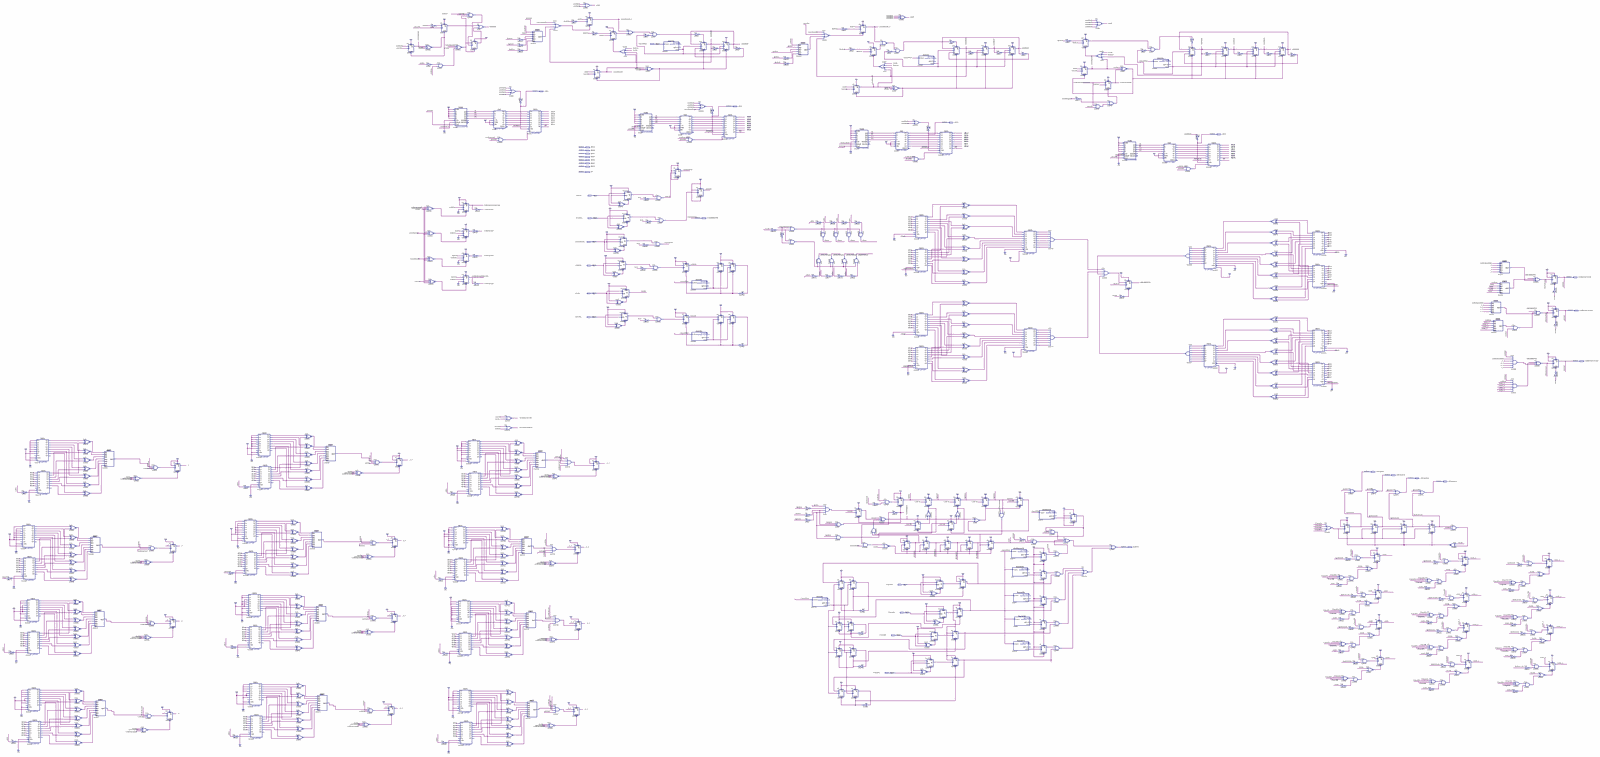
[diagram p0: schematic sheet, whole]
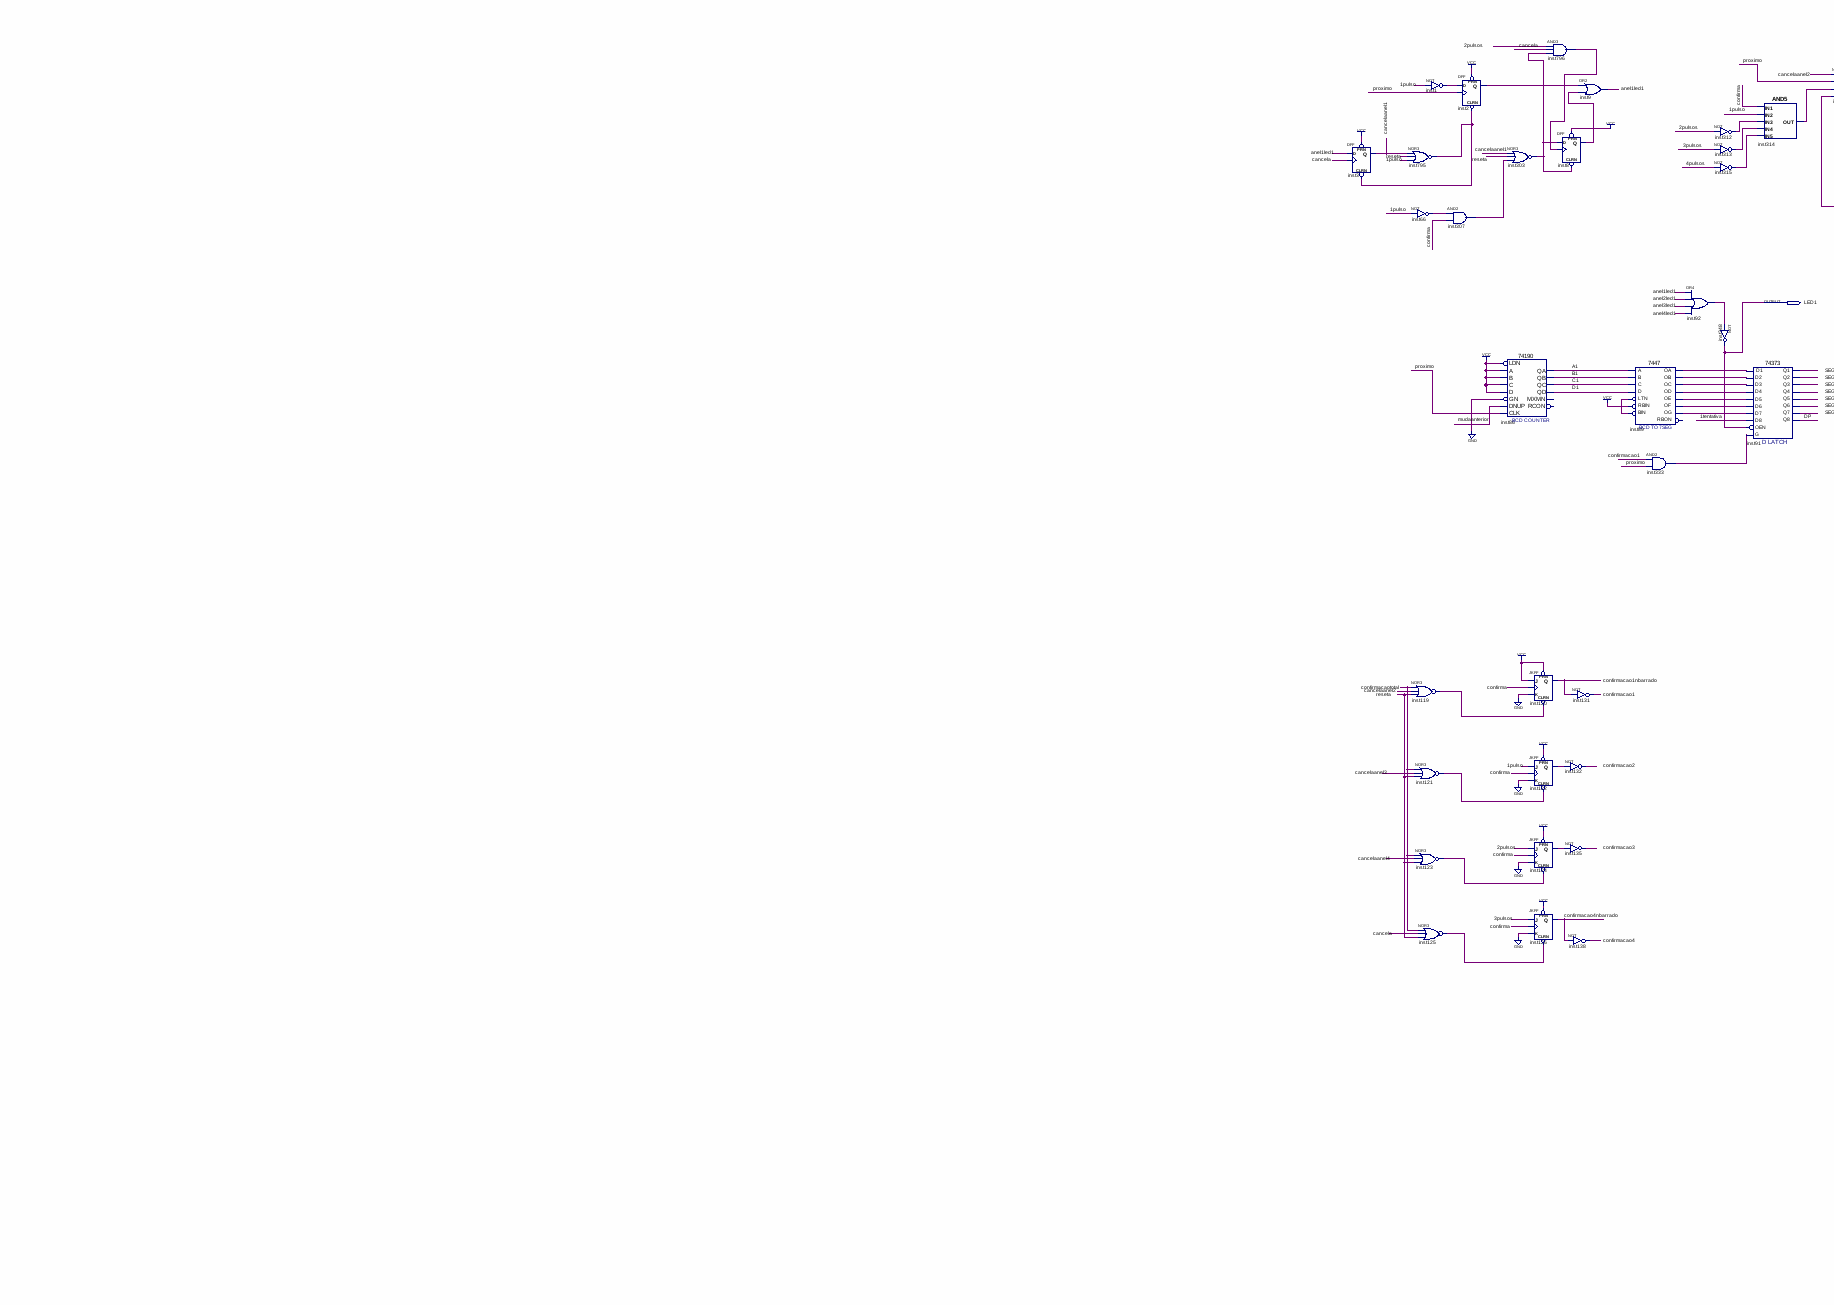
[diagram p1: schematic sheet, upper left part]
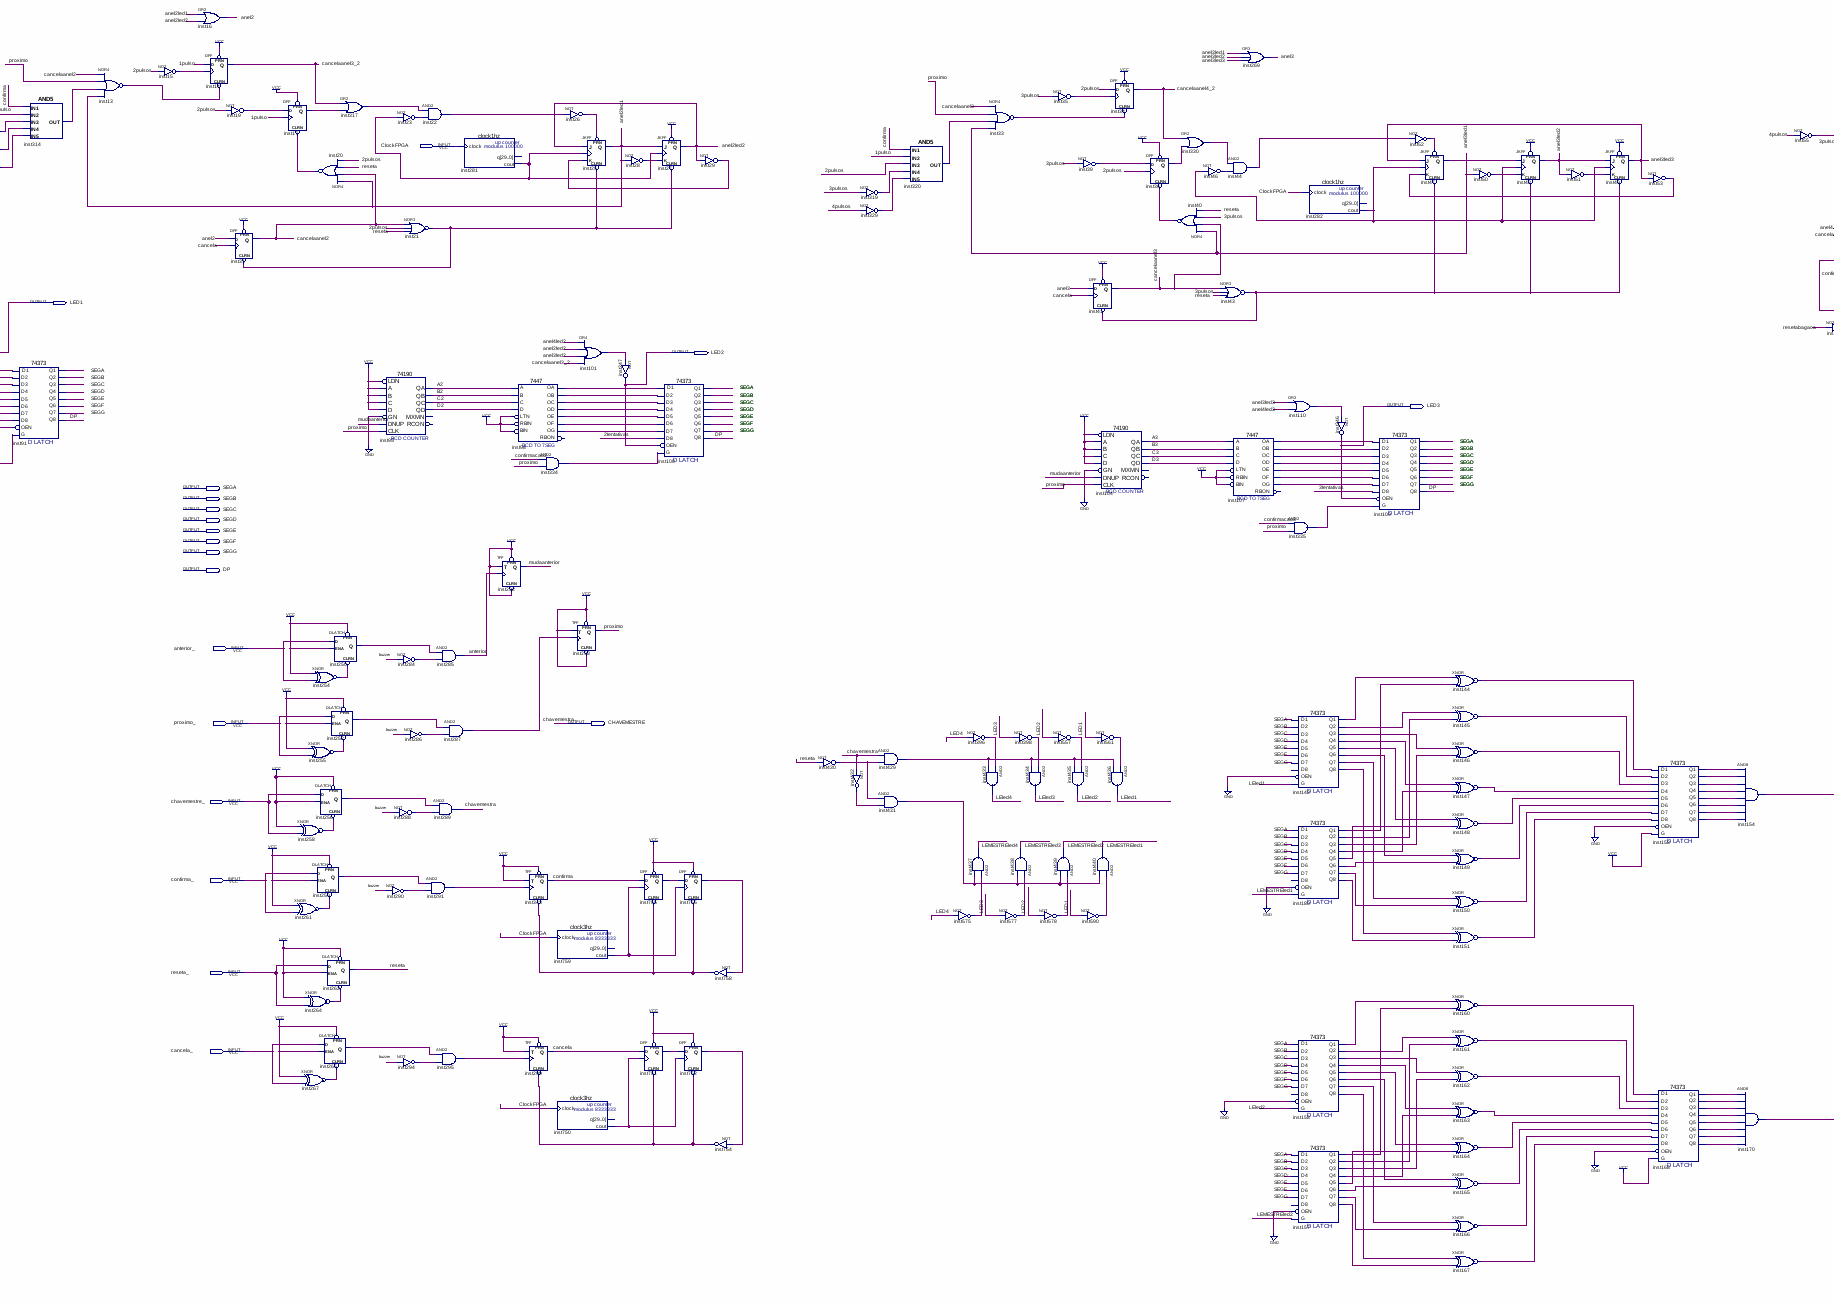
[diagram p2: schematic sheet, upper centre part]
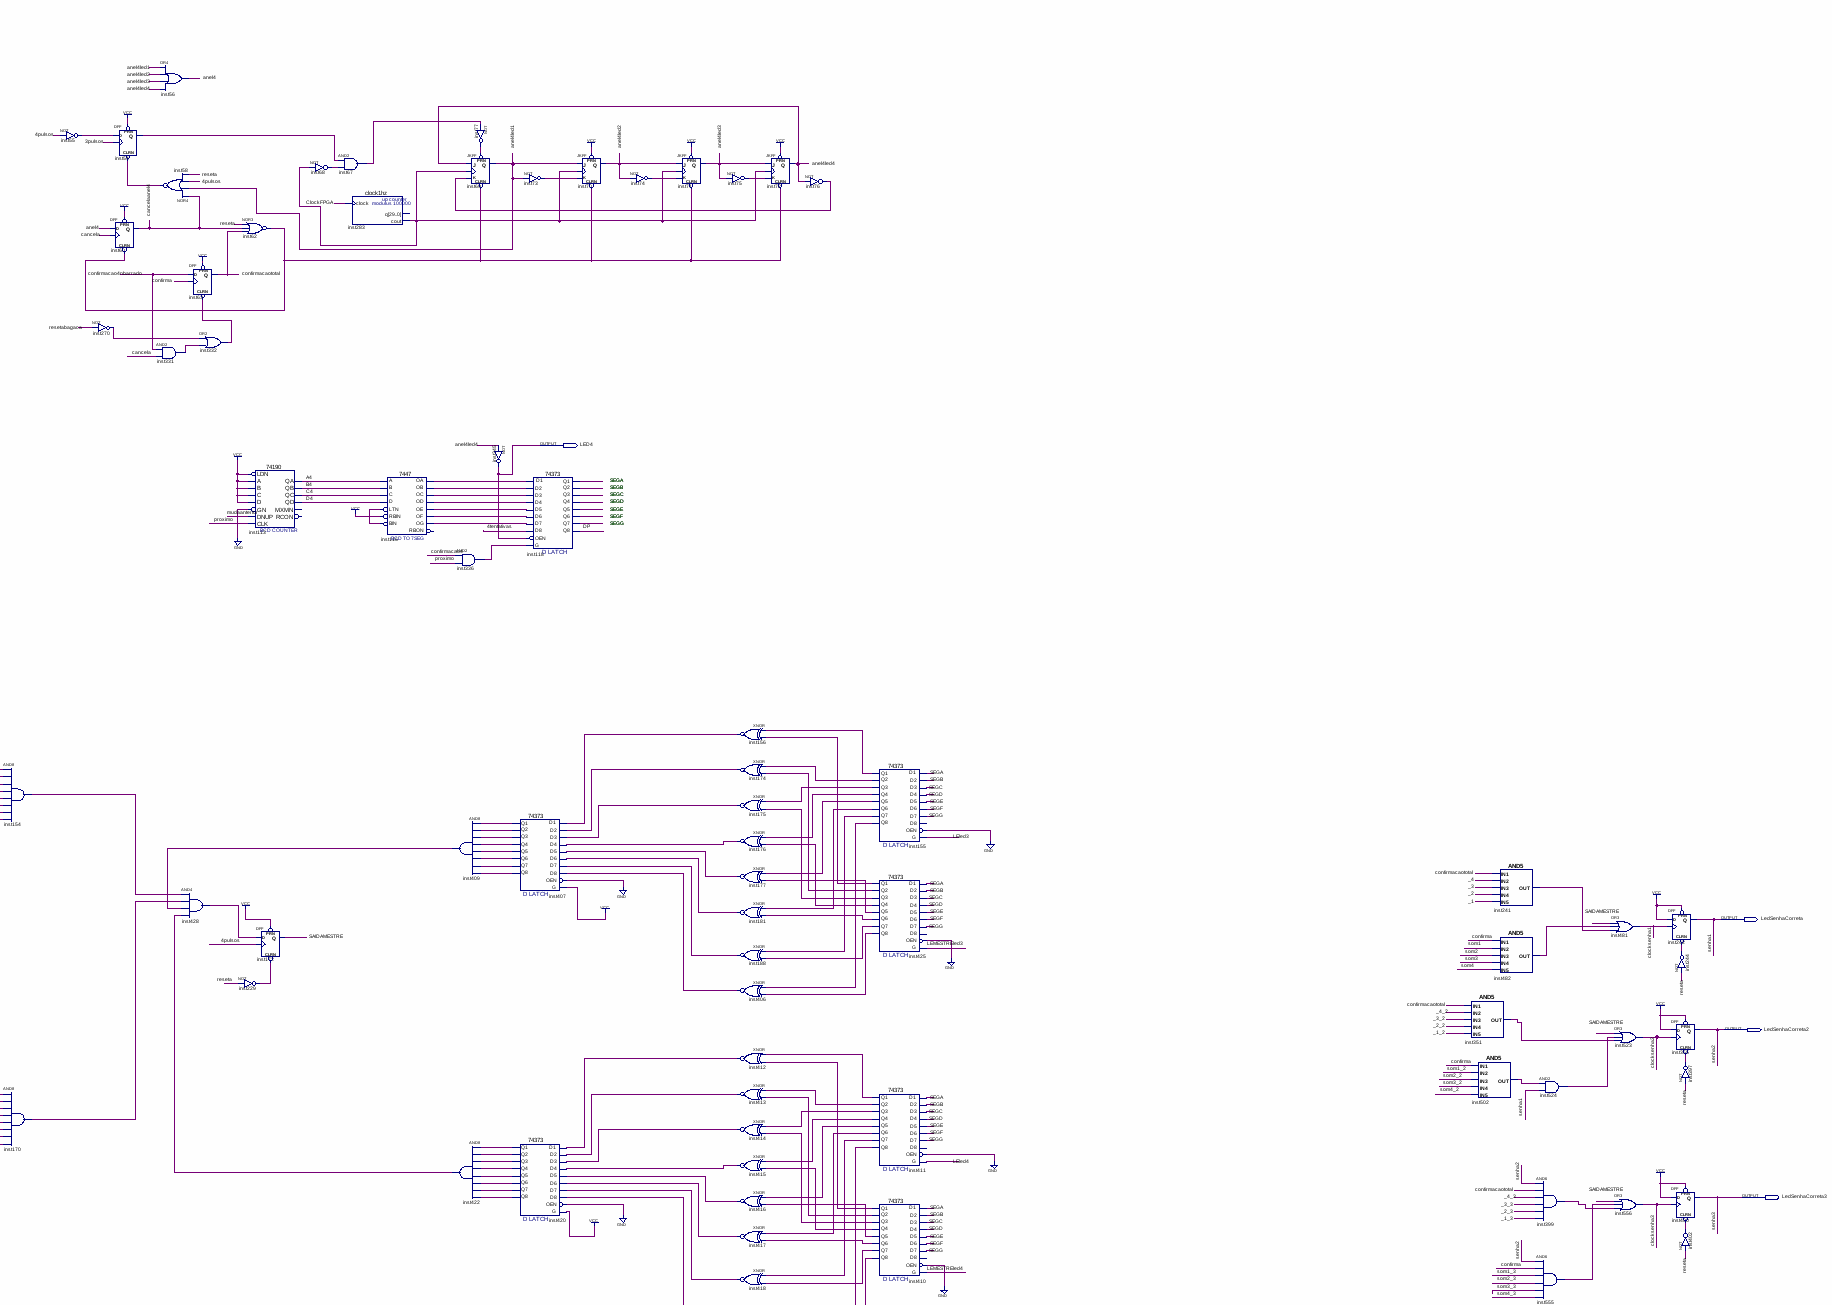
[diagram p3: schematic sheet, upper right part]
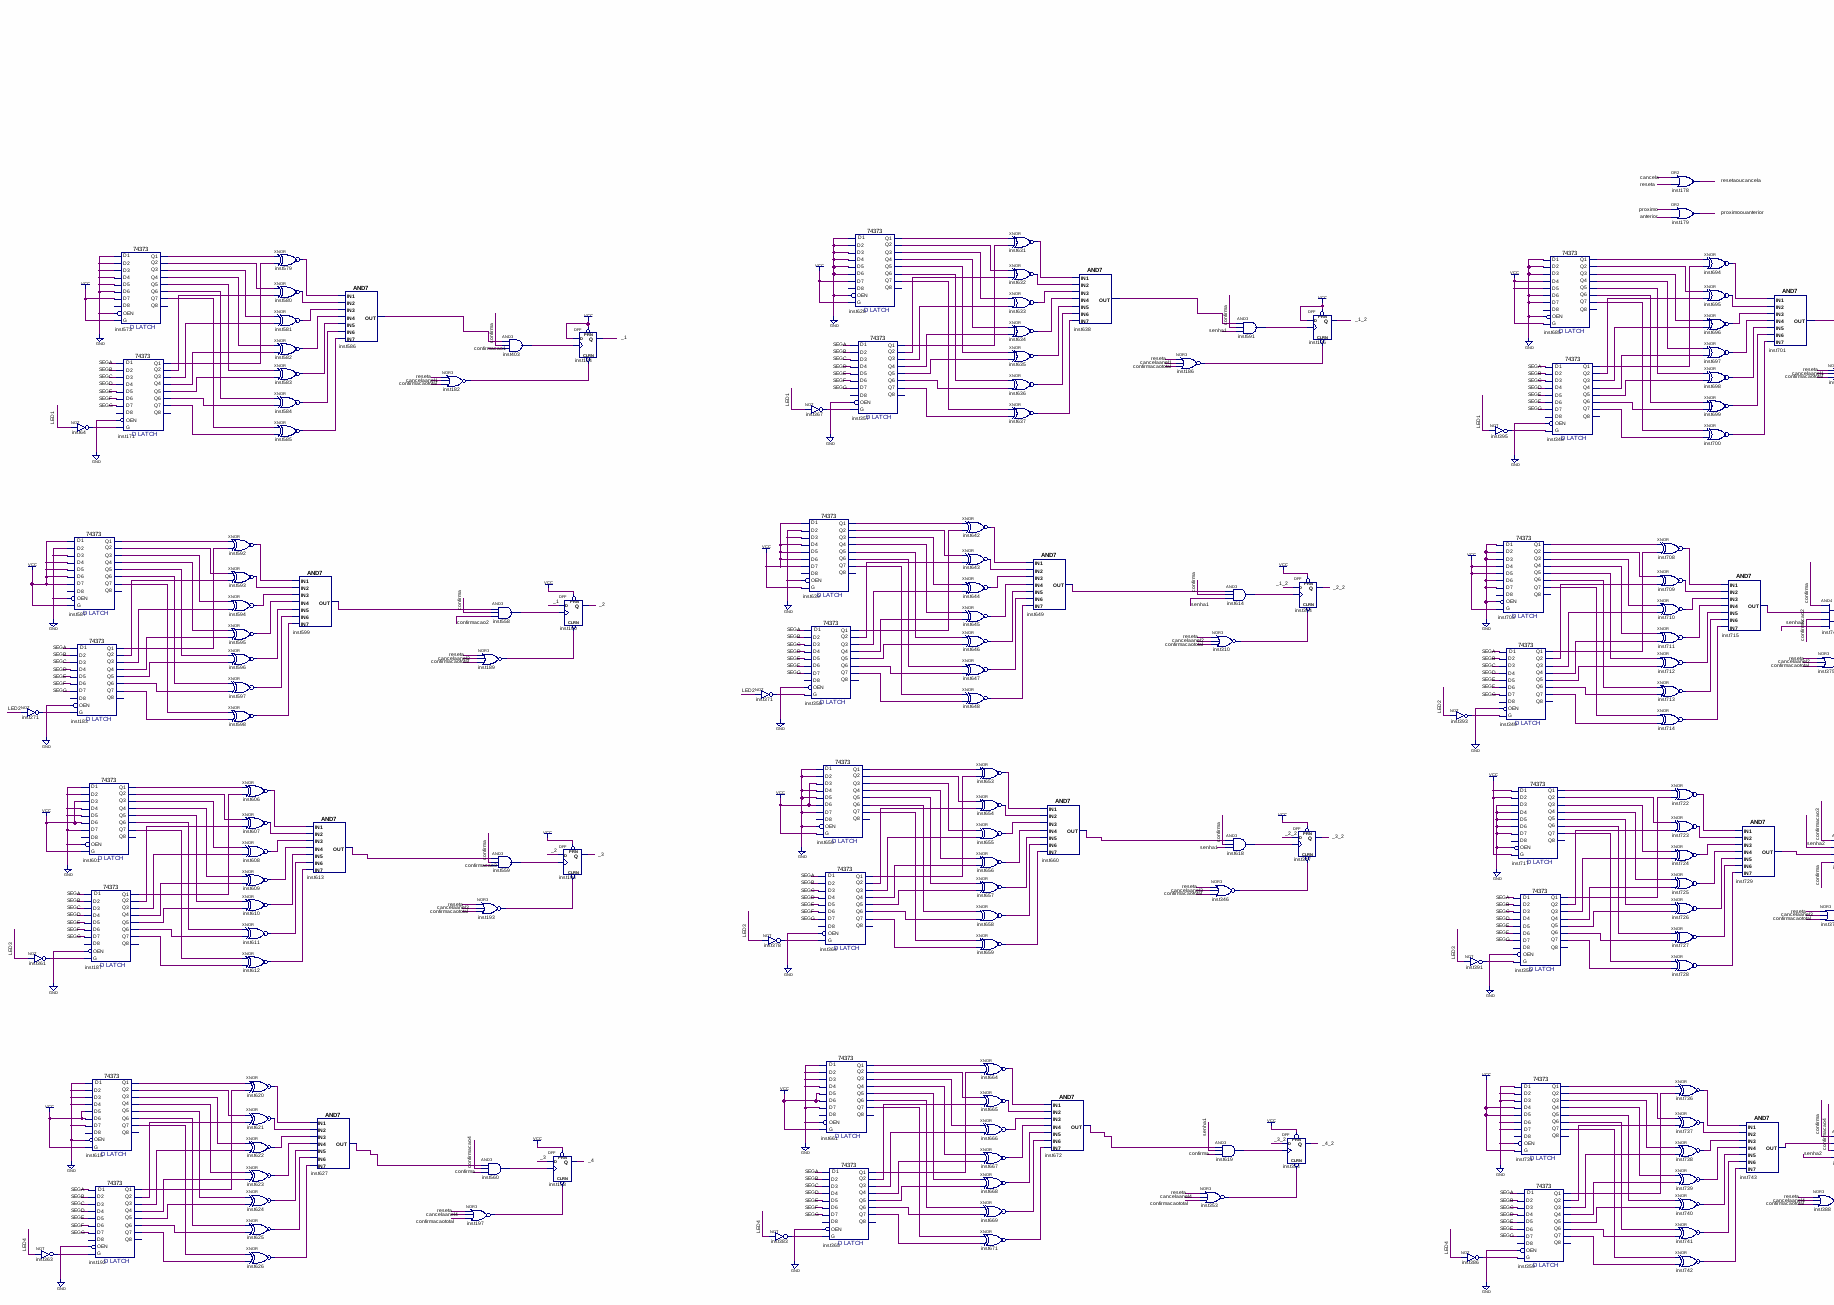
[diagram p4: schematic sheet, lower left part]
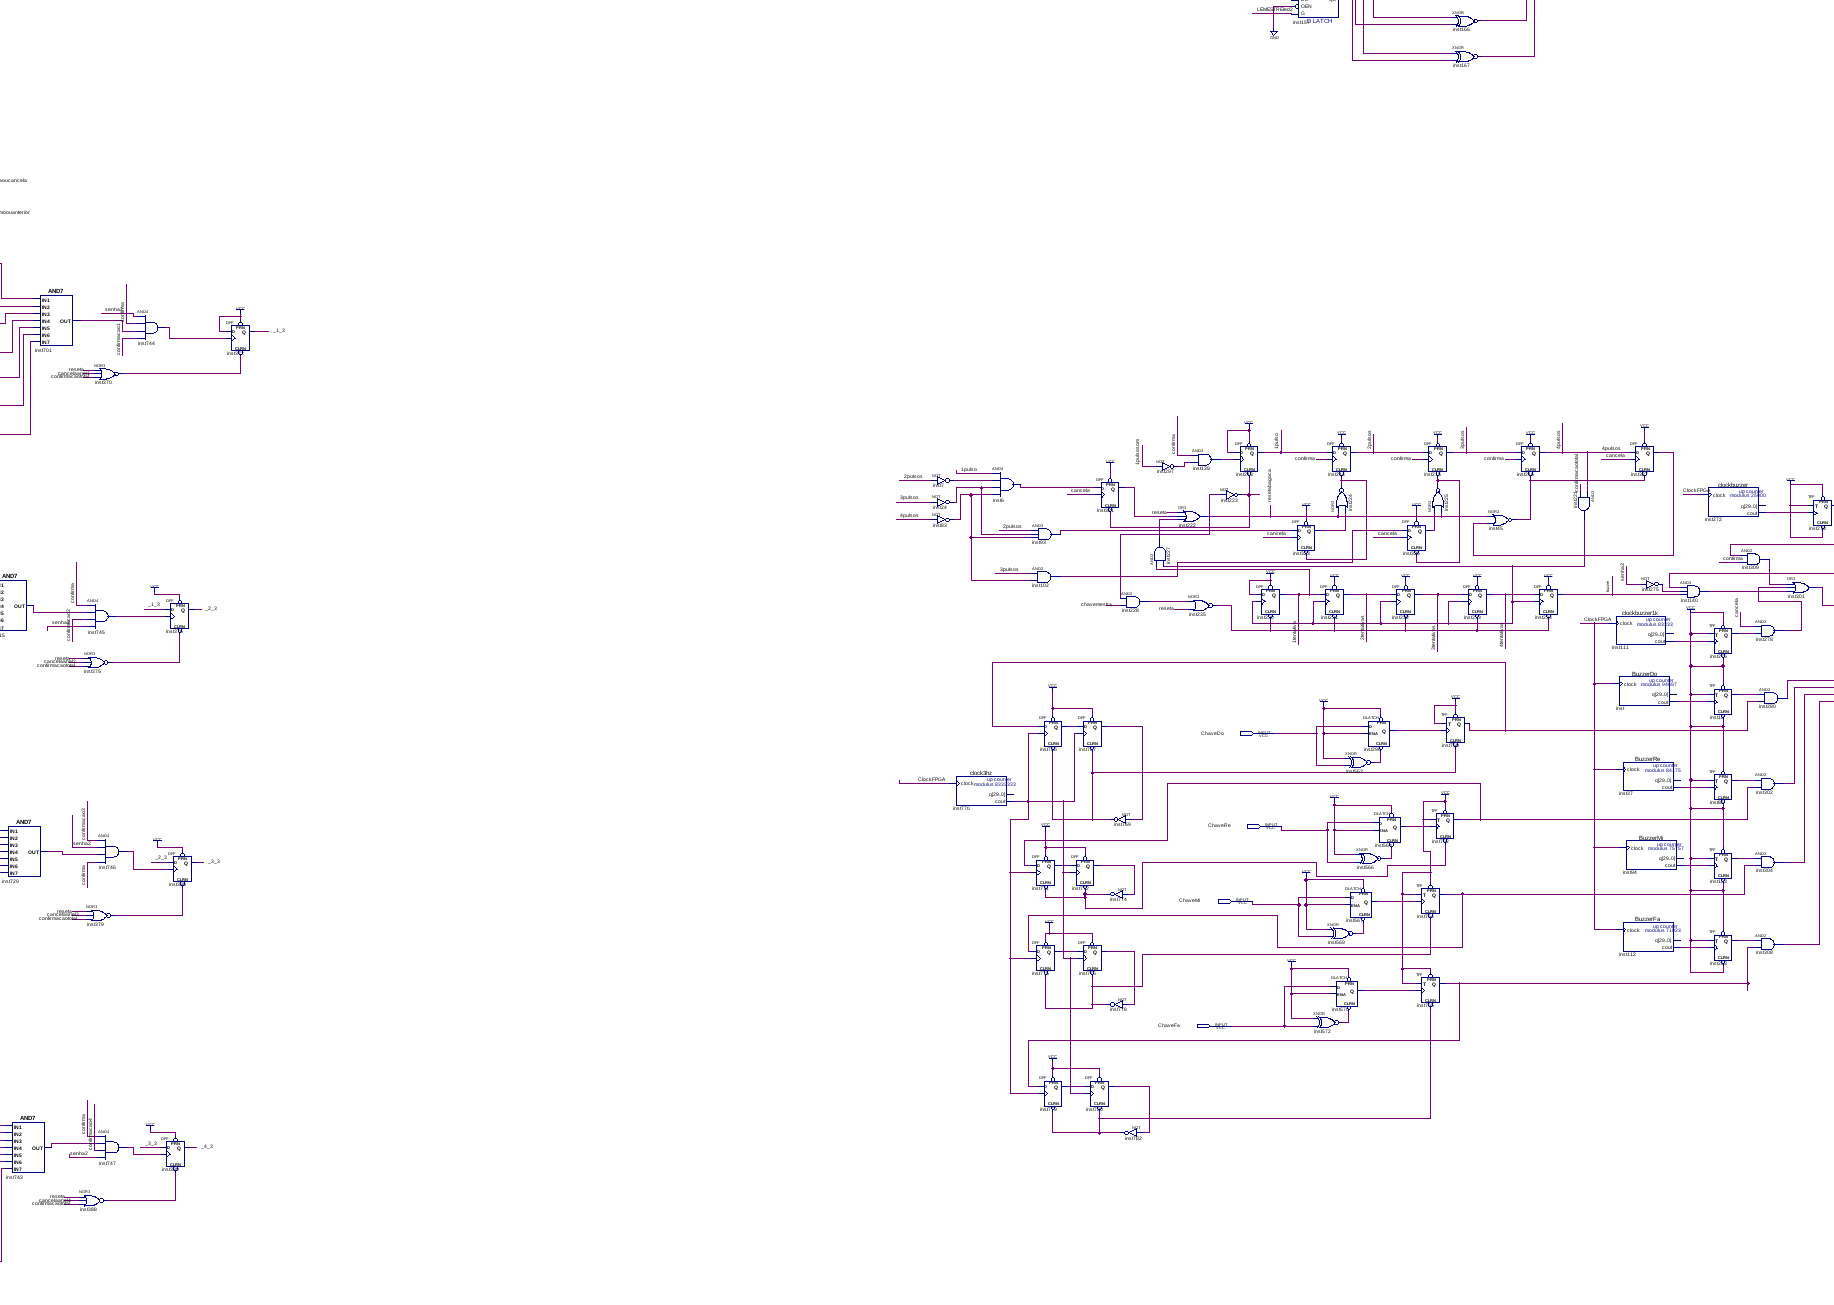
[diagram p5: schematic sheet, lower centre part]
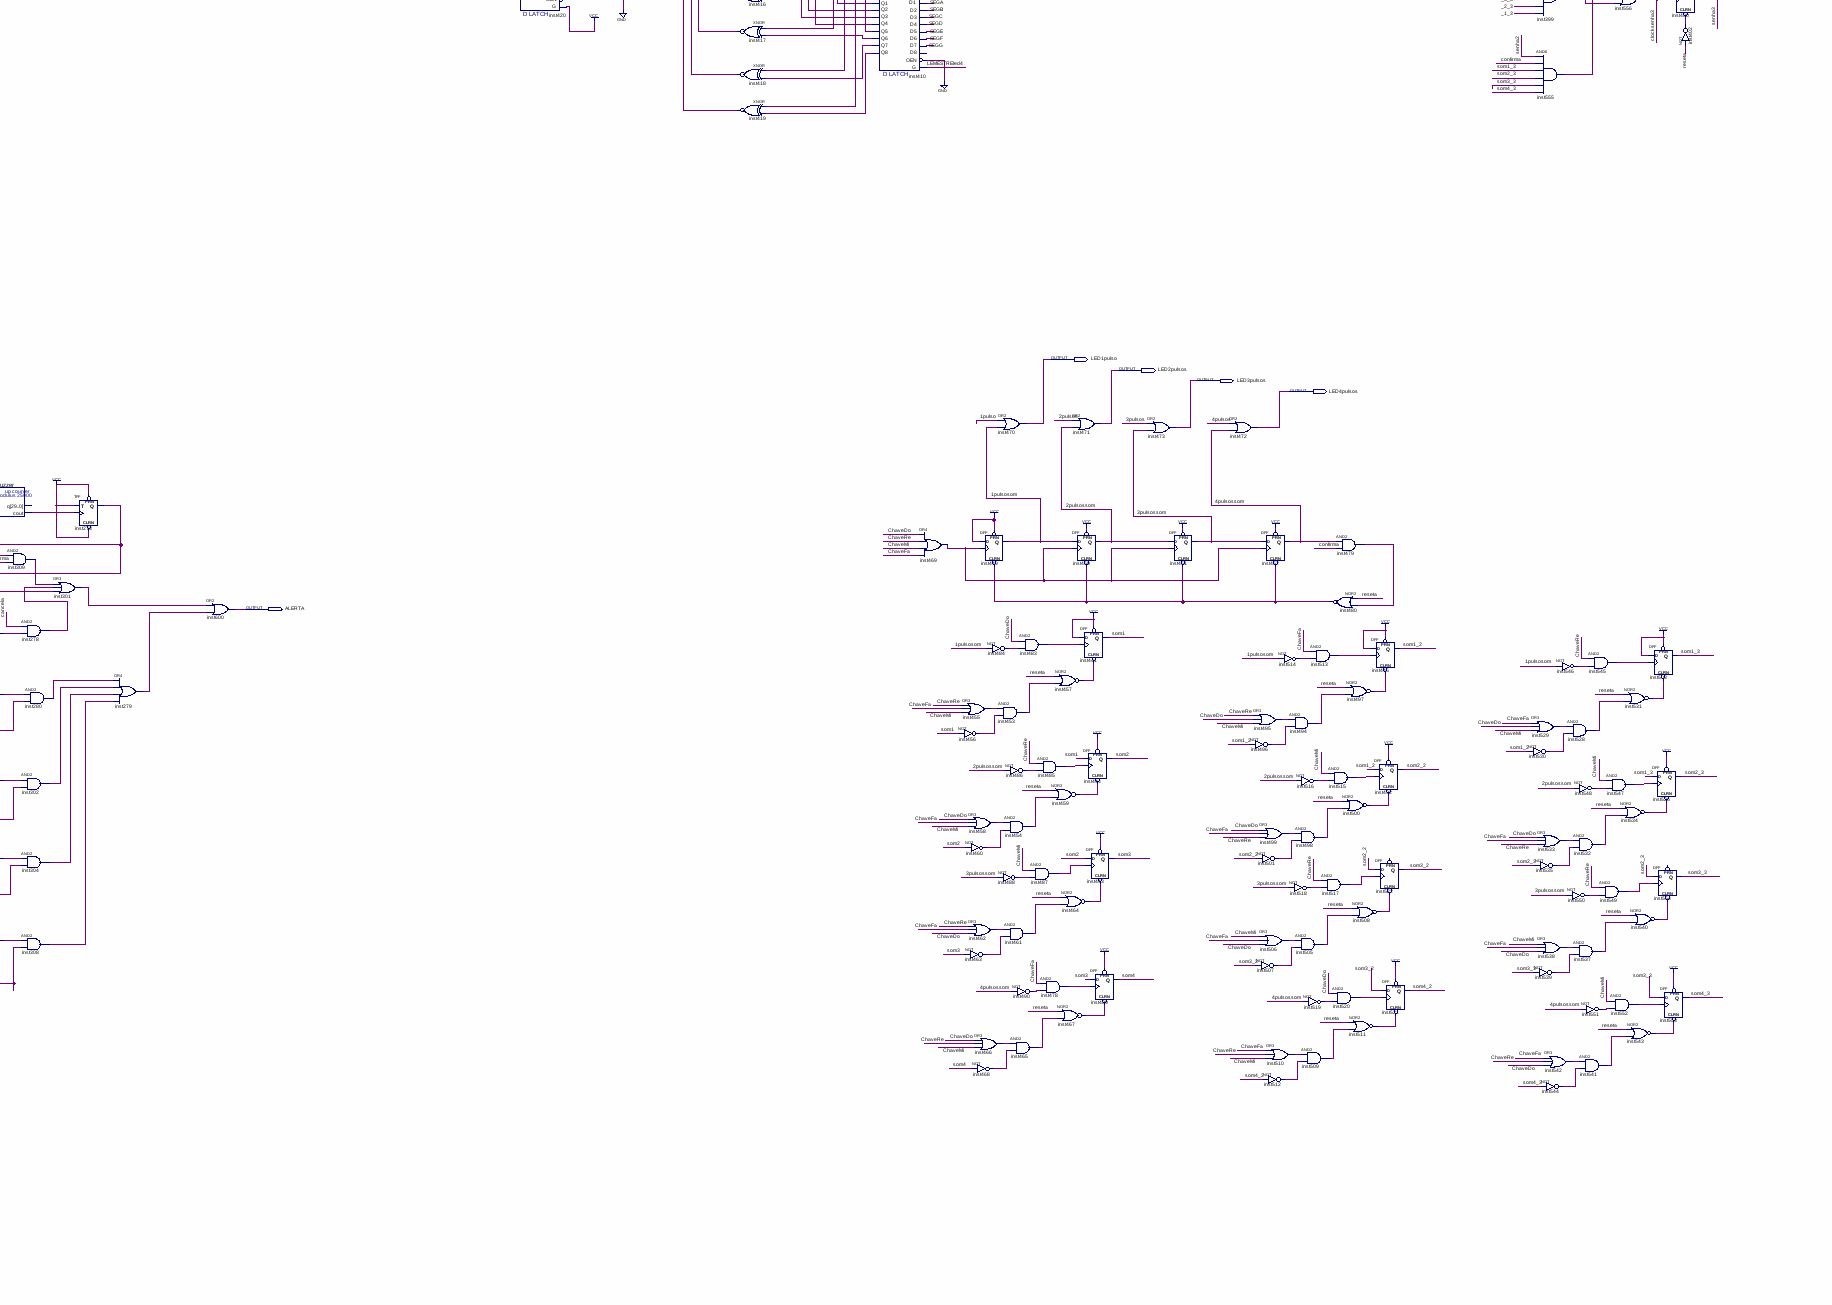
[diagram p6: schematic sheet, lower right part]
// Quartus schematic ProjetoCofreV2.bdf as structural Verilog: 576 symbols, 32 pins
module ProjetoCofreV2 (
  input  ClockFPGA,
  input  anterior_,
  input  proximo_,
  input  chavemestre_,
  input  confirma_,
  input  reseta_,
  input  cancela_,
  input  ChaveDo,
  input  ChaveRe,
  input  ChaveMi,
  input  ChaveFa,
  output LED1,
  output LED2,
  output LED3,
  output LED4,
  output SEGA,
  output SEGB,
  output SEGC,
  output SEGD,
  output SEGE,
  output SEGF,
  output SEGG,
  output DP,
  output CHAVEMESTRE,
  output LedSenhaCorreta,
  output LedSenhaCorreta2,
  output LedSenhaCorreta3,
  output LED1pulso,
  output LED2pulsos,
  output LED3pulsos,
  output LED4pulsos,
  output ALERTA
);

  wire \1pulso , \1pulsosom , \1tentativa , \2pulsos , \2pulsossom , \2tentativas , \3pulsos , \3pulsossom ,
       \3tentativas , \4pulsos , \4pulsossom , \4tentativas , _1, _1_2, _1_3, _2, _2_2, _2_3, _3, _3_2, _3_3,
       _4, _4_2, _4_3, A1, A2, A3, A4, anel1led1, anel2, anel2led1, anel2led2, anel3, anel3led1, anel3led2,
       anel3led3, anel4, anel4led1, anel4led2, anel4led3, anel4led4, anterior, B1, B2, B3, B4, buzzer, C1,
       C2, C3, C4, cancela, cancelaanel1, cancelaanel2, cancelaanel3, cancelaanel3_2, cancelaanel4,
       cancelaanel4_2, clocksenha1, clocksenha2, clocksenha3, confirma, confirmacao1, confirmacao1nbarrado,
       confirmacao2, confirmacao3, confirmacao4, confirmacao4nbarrado, confirmacaototal, D1, D2, D3, D4,
       inst1_out, inst2_q, inst6_out, inst7_out, inst8_q, inst13_out, inst15_out, inst17_q, inst18_q,
       inst19_out, inst20_out, inst21_out, inst22_out, inst23_out, inst24_out, inst26_out, inst28_out,
       inst29_out, inst33_out, inst35_out, inst36_q, inst37_cout, inst39_out, inst40_out, inst43_out,
       inst44_out, inst45_out, inst46_out, inst50_out, inst51_out, inst52_out, inst53_out, inst54_q,
       inst55_out, inst58_out, inst62_out, inst64_out, inst66_out, inst67_out, inst68_out, inst73_out,
       inst74_out, inst75_out, inst76_out, inst77_out, inst83_out, inst85_q, inst89_oa, inst89_ob, inst89_oc,
       inst89_od, inst89_oe, inst89_of, inst89_og, inst92_out, inst93_out, inst94_cout, inst98_oa, inst98_ob,
       inst98_oc, inst98_od, inst98_oe, inst98_of, inst98_og, inst101_out, inst102_out, inst103_q,
       inst107_oa, inst107_ob, inst107_oc, inst107_od, inst107_oe, inst107_of, inst107_og, inst110_out,
       inst111_cout, inst112_cout, inst116_oa, inst116_ob, inst116_oc, inst116_od, inst116_oe, inst116_of,
       inst116_og, inst119_out, inst121_out, inst122_q, inst123_out, inst124_q, inst125_out, inst139_out,
       inst140_out, inst142_q1, inst142_q2, inst142_q3, inst142_q4, inst142_q5, inst142_q6, inst142_q7,
       inst142_q8, inst144_out, inst145_out, inst146_out, inst147_out, inst148_out, inst149_out, inst150_out,
       inst151_out, inst152_q1, inst152_q2, inst152_q3, inst152_q4, inst152_q5, inst152_q6, inst152_q7,
       inst152_q8, inst154_out, inst155_q1, inst155_q2, inst155_q3, inst155_q4, inst155_q5, inst155_q6,
       inst155_q7, inst155_q8, inst156_out, inst157_q1, inst157_q2, inst157_q3, inst157_q4, inst157_q5,
       inst157_q6, inst157_q7, inst157_q8, inst158_q1, inst158_q2, inst158_q3, inst158_q4, inst158_q5,
       inst158_q6, inst158_q7, inst158_q8, inst160_out, inst161_out, inst162_out, inst163_out, inst164_out,
       inst165_out, inst166_out, inst167_out, inst168_q1, inst168_q2, inst168_q3, inst168_q4, inst168_q5,
       inst168_q6, inst168_q7, inst168_q8, inst170_out, inst171_q1, inst171_q2, inst171_q3, inst171_q4,
       inst171_q5, inst171_q6, inst171_q7, inst174_out, inst175_out, inst176_out, inst177_out, inst180_q1,
       inst180_q2, inst180_q3, inst180_q4, inst180_q5, inst180_q6, inst180_q7, inst180_q8, inst181_out,
       inst182_out, inst183_q1, inst183_q2, inst183_q3, inst183_q4, inst183_q5, inst183_q6, inst183_q7,
       inst186_out, inst187_q1, inst187_q2, inst187_q3, inst187_q4, inst187_q5, inst187_q6, inst187_q7,
       inst188_out, inst189_out, inst192_q1, inst192_q2, inst192_q3, inst192_q4, inst192_q5, inst192_q6,
       inst192_q7, inst193_out, inst197_out, inst221_out, inst223_out, inst224_out, inst225_out, inst227_out,
       inst228_out, inst229_out, inst235_out, inst241_out, inst244_out, inst250_q, inst252_q, inst254_out,
       inst255_out, inst256_q, inst258_out, inst259_q, inst261_out, inst264_out, inst265_q, inst267_out,
       inst268_q, inst270_out, inst271_out, inst272_cout, inst273_q, inst275_out, inst276_q, inst278_out,
       inst279_out, inst280_out, inst281_cout, inst282_cout, inst283_cout, inst284_out, inst286_out,
       inst287_out, inst288_out, inst290_out, inst291_out, inst294_out, inst295_out, inst296_q, inst297_out,
       inst301_out, inst302_out, inst303_out, inst304_out, inst307_out, inst308_out, inst309_out,
       inst310_out, inst312_out, inst313_out, inst314_out, inst315_out, inst317_out, inst319_out,
       inst320_out, inst321_q, inst323_q, inst325_q, inst327_q, inst329_out, inst330_out, inst331_out,
       inst332_out, inst333_out, inst334_out, inst335_out, inst336_out, inst346_out, inst348_q1, inst348_q2,
       inst348_q3, inst348_q4, inst348_q5, inst348_q6, inst348_q7, inst349_q1, inst349_q2, inst349_q3,
       inst349_q4, inst349_q5, inst349_q6, inst349_q7, inst350_q1, inst350_q2, inst350_q3, inst350_q4,
       inst350_q5, inst350_q6, inst350_q7, inst351_out, inst353_out, inst357_q1, inst357_q2, inst357_q3,
       inst357_q4, inst357_q5, inst357_q6, inst357_q7, inst358_q1, inst358_q2, inst358_q3, inst358_q4,
       inst358_q5, inst358_q6, inst358_q7, inst359_q1, inst359_q2, inst359_q3, inst359_q4, inst359_q5,
       inst359_q6, inst359_q7, inst361_out, inst363_out, inst364_q1, inst364_q2, inst364_q3, inst364_q4,
       inst364_q5, inst364_q6, inst364_q7, inst365_q1, inst365_q2, inst365_q3, inst365_q4, inst365_q5,
       inst365_q6, inst365_q7, inst367_out, inst370_out, inst371_out, inst375_out, inst378_out, inst379_out,
       inst383_out, inst386_out, inst388_out, inst391_out, inst393_out, inst395_out, inst396_out,
       inst397_out, inst398_out, inst399_out, inst402_out, inst403_out, inst406_out, inst407_q1, inst407_q2,
       inst407_q3, inst407_q4, inst407_q5, inst407_q6, inst407_q7, inst407_q8, inst409_out, inst410_q1,
       inst410_q2, inst410_q3, inst410_q4, inst410_q5, inst410_q6, inst410_q7, inst410_q8, inst411_q1,
       inst411_q2, inst411_q3, inst411_q4, inst411_q5, inst411_q6, inst411_q7, inst411_q8, inst412_out,
       inst413_out, inst414_out, inst415_out, inst416_out, inst417_out, inst418_out, inst419_out, inst420_q1,
       inst420_q2, inst420_q3, inst420_q4, inst420_q5, inst420_q6, inst420_q7, inst420_q8, inst422_out,
       inst425_q1, inst425_q2, inst425_q3, inst425_q4, inst425_q5, inst425_q6, inst425_q7, inst425_q8,
       inst428_out, inst429_out, inst430_out, inst431_out, inst432_out, inst453_out, inst454_out,
       inst455_out, inst456_out, inst457_out, inst458_out, inst459_out, inst460_out, inst461_out,
       inst462_out, inst463_out, inst464_out, inst465_out, inst466_out, inst467_out, inst468_out,
       inst469_out, inst478_out, inst479_out, inst480_out, inst482_out, inst483_out, inst484_out,
       inst485_out, inst486_out, inst487_out, inst488_out, inst490_out, inst494_out, inst495_out,
       inst496_out, inst497_out, inst498_out, inst499_out, inst500_out, inst501_out, inst502_out,
       inst505_out, inst506_out, inst507_out, inst508_out, inst509_out, inst510_out, inst511_out,
       inst512_out, inst513_out, inst514_out, inst515_out, inst516_out, inst517_out, inst518_out,
       inst519_out, inst520_out, inst524_out, inst528_out, inst529_out, inst530_out, inst531_out,
       inst532_out, inst533_out, inst534_out, inst535_out, inst537_out, inst538_out, inst539_out,
       inst540_out, inst541_out, inst542_out, inst543_out, inst544_out, inst545_out, inst546_out,
       inst547_out, inst548_out, inst549_out, inst550_out, inst551_out, inst552_out, inst555_out,
       inst557_out, inst558_out, inst559_out, inst560_out, inst561_out, inst563_out, inst564_q, inst566_out,
       inst567_q, inst569_out, inst570_q, inst572_out, inst573_q1, inst573_q2, inst573_q3, inst573_q4,
       inst573_q5, inst573_q6, inst573_q7, inst575_out, inst577_out, inst578_out, inst579_out, inst580_out,
       inst581_out, inst582_out, inst583_out, inst584_out, inst585_out, inst586_out, inst587_q1, inst587_q2,
       inst587_q3, inst587_q4, inst587_q5, inst587_q6, inst587_q7, inst590_out, inst591_out, inst592_out,
       inst593_out, inst594_out, inst595_out, inst596_out, inst597_out, inst598_out, inst599_out, inst601_q1,
       inst601_q2, inst601_q3, inst601_q4, inst601_q5, inst601_q6, inst601_q7, inst606_out, inst607_out,
       inst608_out, inst609_out, inst610_out, inst611_out, inst612_out, inst613_out, inst614_out, inst615_q1,
       inst615_q2, inst615_q3, inst615_q4, inst615_q5, inst615_q6, inst615_q7, inst618_out, inst619_out,
       inst620_out, inst621_out, inst622_out, inst623_out, inst624_out, inst625_out, inst626_out,
       inst627_out, inst628_q1, inst628_q2, inst628_q3, inst628_q4, inst628_q5, inst628_q6, inst628_q7,
       inst631_out, inst632_out, inst633_out, inst634_out, inst635_out, inst636_out, inst637_out,
       inst638_out, inst639_q1, inst639_q2, inst639_q3, inst639_q4, inst639_q5, inst639_q6, inst639_q7,
       inst642_out, inst643_out, inst644_out, inst645_out, inst646_out, inst647_out, inst648_out,
       inst649_out, inst650_q1, inst650_q2, inst650_q3, inst650_q4, inst650_q5, inst650_q6, inst650_q7,
       inst653_out, inst654_out, inst655_out, inst656_out, inst657_out, inst658_out, inst659_out,
       inst660_out, inst661_q1, inst661_q2, inst661_q3, inst661_q4, inst661_q5, inst661_q6, inst661_q7,
       inst664_out, inst665_out, inst666_out, inst667_out, inst668_out, inst669_out, inst671_out,
       inst672_out, inst685_q1, inst685_q2, inst685_q3, inst685_q4, inst685_q5, inst685_q6, inst685_q7,
       inst694_out, inst695_out, inst696_out, inst697_out, inst698_out, inst699_out, inst700_out,
       inst701_out, inst703_q1, inst703_q2, inst703_q3, inst703_q4, inst703_q5, inst703_q6, inst703_q7,
       inst708_out, inst709_out, inst710_out, inst711_out, inst712_out, inst713_out, inst714_out,
       inst715_out, inst717_q1, inst717_q2, inst717_q3, inst717_q4, inst717_q5, inst717_q6, inst717_q7,
       inst722_out, inst723_out, inst724_out, inst725_out, inst726_out, inst727_out, inst728_out,
       inst729_out, inst731_q1, inst731_q2, inst731_q3, inst731_q4, inst731_q5, inst731_q6, inst731_q7,
       inst736_out, inst737_out, inst738_out, inst739_out, inst740_out, inst741_out, inst742_out,
       inst743_out, inst744_out, inst745_out, inst746_out, inst747_out, inst750_cout, inst751_q, inst752_q,
       inst754_out, inst755_q, inst756_q, inst758_out, inst759_cout, inst760_q, inst762_q, inst764_q,
       inst765_q, inst766_q, inst767_q, inst769_out, inst770_cout, inst771_q, inst772_q, inst774_out,
       inst775_q, inst776_q, inst778_out, inst779_q, inst780_q, inst782_out, inst795_out, inst796_out,
       inst_cout, LEled1, LEled2, LEled3, LEled4, LEMESTREled1, LEMESTREled2, LEMESTREled3, LEMESTREled4,
       mudaanterior, proximo, proximoouanterior, reseta, resetabagaca, resetaoucancela, SAIDAMESTRE, som1,
       som1_2, som1_3, som2, som2_2, som2_3, som3, som3_2, som3_3, som4, som4_2, som4_3;

  not inst271 (inst271_out, LED2);
  not inst361 (inst361_out, LED3);
  not inst363 (inst363_out, LED4);
  not inst64 (inst64_out, LED1);
  \74373  inst587 (
    .D1(1'b1), .D3(1'b0), .D6(1'b1), .D7(1'b1), .D2(1'b0), .G(1'b1), .D4(1'b1), .D5(1'b1), .OEN(1'b0),
    .Q3(inst587_q3), .Q6(inst587_q6), .Q7(inst587_q7), .Q2(inst587_q2), .Q4(inst587_q4), .Q5(inst587_q5),
    .Q1(inst587_q1));  // open: D8, Q8
  \74373  inst183 (
    .D1(SEGA), .D3(SEGC), .D6(SEGF), .D7(SEGG), .D2(SEGB), .G(inst271_out), .D4(SEGD), .D5(SEGE), .OEN(1'b0),
    .Q3(inst183_q3), .Q6(inst183_q6), .Q7(inst183_q7), .Q2(inst183_q2), .Q4(inst183_q4), .Q5(inst183_q5),
    .Q1(inst183_q1));  // open: D8, Q8
  \74373  inst601 (
    .D1(1'b0), .D3(1'b1), .D6(1'b1), .D7(1'b0), .D2(1'b0), .G(1'b1), .D4(1'b0), .D5(1'b0), .OEN(1'b0),
    .Q3(inst601_q3), .Q6(inst601_q6), .Q7(inst601_q7), .Q2(inst601_q2), .Q4(inst601_q4), .Q5(inst601_q5),
    .Q1(inst601_q1));  // open: D8, Q8
  \74373  inst187 (
    .D1(SEGA), .D3(SEGC), .D6(SEGF), .D7(SEGG), .D2(SEGB), .G(inst361_out), .D4(SEGD), .D5(SEGE), .OEN(1'b0),
    .Q3(inst187_q3), .Q6(inst187_q6), .Q7(inst187_q7), .Q2(inst187_q2), .Q4(inst187_q4), .Q5(inst187_q5),
    .Q1(inst187_q1));  // open: D8, Q8
  \74373  inst615 (
    .D1(1'b0), .D3(1'b0), .D6(1'b1), .D7(1'b0), .D2(1'b0), .G(1'b1), .D4(1'b0), .D5(1'b1), .OEN(1'b0),
    .Q3(inst615_q3), .Q6(inst615_q6), .Q7(inst615_q7), .Q2(inst615_q2), .Q4(inst615_q4), .Q5(inst615_q5),
    .Q1(inst615_q1));  // open: D8, Q8
  \74373  inst192 (
    .D1(SEGA), .D3(SEGC), .D6(SEGF), .D7(SEGG), .D2(SEGB), .G(inst363_out), .D4(SEGD), .D5(SEGE), .OEN(1'b0),
    .Q3(inst192_q3), .Q6(inst192_q6), .Q7(inst192_q7), .Q2(inst192_q2), .Q4(inst192_q4), .Q5(inst192_q5),
    .Q1(inst192_q1));  // open: D8, Q8
  \74373  inst573 (
    .D1(1'b0), .D3(1'b0), .D6(1'b0), .D7(1'b1), .D2(1'b0), .G(1'b1), .D4(1'b0), .D5(1'b0), .OEN(1'b0),
    .Q3(inst573_q3), .Q6(inst573_q6), .Q7(inst573_q7), .Q2(inst573_q2), .Q4(inst573_q4), .Q5(inst573_q5),
    .Q1(inst573_q1));  // open: D8, Q8
  \74373  inst171 (
    .D1(SEGA), .D3(SEGC), .D6(SEGF), .D7(SEGG), .D2(SEGB), .G(inst64_out), .D4(SEGD), .D5(SEGE), .OEN(1'b0),
    .Q3(inst171_q3), .Q6(inst171_q6), .Q7(inst171_q7), .Q2(inst171_q2), .Q4(inst171_q4), .Q5(inst171_q5),
    .Q1(inst171_q1));  // open: D8, Q8
  xnor inst592 (inst592_out, inst587_q1, inst183_q1);
  xnor inst593 (inst593_out, inst587_q2, inst183_q2);
  xnor inst594 (inst594_out, inst587_q3, inst183_q3);
  xnor inst595 (inst595_out, inst587_q4, inst183_q4);
  xnor inst596 (inst596_out, inst587_q5, inst183_q5);
  xnor inst597 (inst597_out, inst587_q6, inst183_q6);
  xnor inst598 (inst598_out, inst587_q7, inst183_q7);
  xnor inst606 (inst606_out, inst601_q1, inst187_q1);
  xnor inst607 (inst607_out, inst601_q2, inst187_q2);
  xnor inst608 (inst608_out, inst601_q3, inst187_q3);
  xnor inst609 (inst609_out, inst601_q4, inst187_q4);
  xnor inst610 (inst610_out, inst601_q5, inst187_q5);
  xnor inst611 (inst611_out, inst601_q6, inst187_q6);
  xnor inst612 (inst612_out, inst601_q7, inst187_q7);
  xnor inst620 (inst620_out, inst615_q1, inst192_q1);
  xnor inst621 (inst621_out, inst615_q2, inst192_q2);
  xnor inst622 (inst622_out, inst615_q3, inst192_q3);
  xnor inst623 (inst623_out, inst615_q4, inst192_q4);
  xnor inst624 (inst624_out, inst615_q5, inst192_q5);
  xnor inst625 (inst625_out, inst615_q6, inst192_q6);
  xnor inst626 (inst626_out, inst615_q7, inst192_q7);
  xnor inst579 (inst579_out, inst573_q1, inst171_q1);
  xnor inst580 (inst580_out, inst573_q2, inst171_q2);
  xnor inst581 (inst581_out, inst573_q3, inst171_q3);
  xnor inst582 (inst582_out, inst573_q4, inst171_q4);
  xnor inst583 (inst583_out, inst573_q5, inst171_q5);
  xnor inst584 (inst584_out, inst573_q6, inst171_q6);
  xnor inst585 (inst585_out, inst573_q7, inst171_q7);
  and inst599 (inst599_out, inst592_out, inst593_out, inst594_out, inst595_out, inst596_out, inst597_out, inst598_out);
  and inst613 (inst613_out, inst606_out, inst607_out, inst608_out, inst609_out, inst610_out, inst611_out, inst612_out);
  and inst627 (inst627_out, inst620_out, inst621_out, inst622_out, inst623_out, inst624_out, inst625_out, inst626_out);
  and inst586 (inst586_out, inst579_out, inst580_out, inst581_out, inst582_out, inst583_out, inst584_out, inst585_out);
  nor inst182 (inst182_out, reseta, cancelaanel1, confirmacaototal);
  nor inst193 (inst193_out, reseta, cancelaanel3, confirmacaototal);
  nor inst197 (inst197_out, reseta, cancelaanel4, confirmacaototal);
  and inst403 (inst403_out, inst586_out, confirma, confirmacao1);
  and inst558 (inst558_out, inst599_out, confirma, confirmacao2);
  nor inst189 (inst189_out, reseta, cancelaanel2, confirmacaototal);
  and inst559 (inst559_out, inst613_out, confirma, confirmacao3);
  and inst560 (inst560_out, inst627_out, confirmacao4, confirma);
  DFF inst190 (.CLRN(inst189_out), .CLK(inst558_out), .D(_1), .PRN(1'b1), .Q(_2));
  DFF inst194 (.CLRN(inst193_out), .CLK(inst559_out), .D(_2), .PRN(1'b1), .Q(_3));
  DFF inst198 (.CLRN(inst197_out), .CLK(inst560_out), .D(_3), .PRN(1'b1), .Q(_4));
  DFF inst184 (.CLRN(inst182_out), .CLK(inst403_out), .D(1'b1), .PRN(1'b1), .Q(_1));
  not inst371 (inst371_out, LED2);
  not inst378 (inst378_out, LED3);
  not inst383 (inst383_out, LED4);
  not inst367 (inst367_out, LED1);
  \74373  inst639 (
    .D1(1'b1), .D3(1'b0), .D6(1'b1), .D7(1'b1), .D2(1'b0), .G(1'b1), .D4(1'b1), .D5(1'b1), .OEN(1'b0),
    .Q3(inst639_q3), .Q6(inst639_q6), .Q7(inst639_q7), .Q2(inst639_q2), .Q4(inst639_q4), .Q5(inst639_q5),
    .Q1(inst639_q1));  // open: D8, Q8
  \74373  inst358 (
    .D1(SEGA), .D3(SEGC), .D6(SEGF), .D7(SEGG), .D2(SEGB), .G(inst371_out), .D4(SEGD), .D5(SEGE), .OEN(1'b0),
    .Q3(inst358_q3), .Q6(inst358_q6), .Q7(inst358_q7), .Q2(inst358_q2), .Q4(inst358_q4), .Q5(inst358_q5),
    .Q1(inst358_q1));  // open: D8, Q8
  \74373  inst650 (
    .D1(1'b0), .D3(1'b1), .D6(1'b1), .D7(1'b0), .D2(1'b0), .G(1'b1), .D4(1'b0), .D5(1'b0), .OEN(1'b0),
    .Q3(inst650_q3), .Q6(inst650_q6), .Q7(inst650_q7), .Q2(inst650_q2), .Q4(inst650_q4), .Q5(inst650_q5),
    .Q1(inst650_q1));  // open: D8, Q8
  \74373  inst364 (
    .D1(SEGA), .D3(SEGC), .D6(SEGF), .D7(SEGG), .D2(SEGB), .G(inst378_out), .D4(SEGD), .D5(SEGE), .OEN(1'b0),
    .Q3(inst364_q3), .Q6(inst364_q6), .Q7(inst364_q7), .Q2(inst364_q2), .Q4(inst364_q4), .Q5(inst364_q5),
    .Q1(inst364_q1));  // open: D8, Q8
  \74373  inst661 (
    .D1(1'b0), .D3(1'b0), .D6(1'b1), .D7(1'b0), .D2(1'b0), .G(1'b1), .D4(1'b0), .D5(1'b1), .OEN(1'b0),
    .Q3(inst661_q3), .Q6(inst661_q6), .Q7(inst661_q7), .Q2(inst661_q2), .Q4(inst661_q4), .Q5(inst661_q5),
    .Q1(inst661_q1));  // open: D8, Q8
  \74373  inst365 (
    .D1(SEGA), .D3(SEGC), .D6(SEGF), .D7(SEGG), .D2(SEGB), .G(inst383_out), .D4(SEGD), .D5(SEGE), .OEN(1'b0),
    .Q3(inst365_q3), .Q6(inst365_q6), .Q7(inst365_q7), .Q2(inst365_q2), .Q4(inst365_q4), .Q5(inst365_q5),
    .Q1(inst365_q1));  // open: D8, Q8
  \74373  inst628 (
    .D1(1'b0), .D3(1'b0), .D6(1'b0), .D7(1'b1), .D2(1'b0), .G(1'b1), .D4(1'b0), .D5(1'b0), .OEN(1'b0),
    .Q3(inst628_q3), .Q6(inst628_q6), .Q7(inst628_q7), .Q2(inst628_q2), .Q4(inst628_q4), .Q5(inst628_q5),
    .Q1(inst628_q1));  // open: D8, Q8
  \74373  inst357 (
    .D1(SEGA), .D3(SEGC), .D6(SEGF), .D7(SEGG), .D2(SEGB), .G(inst367_out), .D4(SEGD), .D5(SEGE), .OEN(1'b0),
    .Q3(inst357_q3), .Q6(inst357_q6), .Q7(inst357_q7), .Q2(inst357_q2), .Q4(inst357_q4), .Q5(inst357_q5),
    .Q1(inst357_q1));  // open: D8, Q8
  xnor inst642 (inst642_out, inst639_q1, inst358_q1);
  xnor inst643 (inst643_out, inst639_q2, inst358_q2);
  xnor inst644 (inst644_out, inst639_q3, inst358_q3);
  xnor inst645 (inst645_out, inst639_q4, inst358_q4);
  xnor inst646 (inst646_out, inst639_q5, inst358_q5);
  xnor inst647 (inst647_out, inst639_q6, inst358_q6);
  xnor inst648 (inst648_out, inst639_q7, inst358_q7);
  xnor inst653 (inst653_out, inst650_q1, inst364_q1);
  xnor inst654 (inst654_out, inst650_q2, inst364_q2);
  xnor inst655 (inst655_out, inst650_q3, inst364_q3);
  xnor inst656 (inst656_out, inst650_q4, inst364_q4);
  xnor inst657 (inst657_out, inst650_q5, inst364_q5);
  xnor inst658 (inst658_out, inst650_q6, inst364_q6);
  xnor inst659 (inst659_out, inst650_q7, inst364_q7);
  xnor inst664 (inst664_out, inst661_q1, inst365_q1);
  xnor inst665 (inst665_out, inst661_q2, inst365_q2);
  xnor inst666 (inst666_out, inst661_q3, inst365_q3);
  xnor inst667 (inst667_out, inst661_q4, inst365_q4);
  xnor inst668 (inst668_out, inst661_q5, inst365_q5);
  xnor inst669 (inst669_out, inst661_q6, inst365_q6);
  xnor inst671 (inst671_out, inst661_q7, inst365_q7);
  xnor inst631 (inst631_out, inst628_q1, inst357_q1);
  xnor inst632 (inst632_out, inst628_q2, inst357_q2);
  xnor inst633 (inst633_out, inst628_q3, inst357_q3);
  xnor inst634 (inst634_out, inst628_q4, inst357_q4);
  xnor inst635 (inst635_out, inst628_q5, inst357_q5);
  xnor inst636 (inst636_out, inst628_q6, inst357_q6);
  xnor inst637 (inst637_out, inst628_q7, inst357_q7);
  and inst649 (inst649_out, inst642_out, inst643_out, inst644_out, inst645_out, inst646_out, inst647_out, inst648_out);
  and inst660 (inst660_out, inst653_out, inst654_out, inst655_out, inst656_out, inst657_out, inst658_out, inst659_out);
  and inst672 (inst672_out, inst664_out, inst665_out, inst666_out, inst667_out, inst668_out, inst669_out, inst671_out);
  and inst638 (inst638_out, inst631_out, inst632_out, inst633_out, inst634_out, inst635_out, inst636_out, inst637_out);
  nor inst186 (inst186_out, reseta, cancelaanel1, confirmacaototal);
  nor inst310 (inst310_out, reseta, cancelaanel2, confirmacaototal);
  nor inst346 (inst346_out, reseta, cancelaanel3, confirmacaototal);
  and inst619 (inst619_out, inst672_out, LedSenhaCorreta, confirma);
  nor inst353 (inst353_out, reseta, cancelaanel4, confirmacaototal);
  and inst591 (inst591_out, inst638_out, confirma, LedSenhaCorreta);
  and inst614 (inst614_out, inst649_out, confirma, LedSenhaCorreta);
  and inst618 (inst618_out, inst660_out, confirma, LedSenhaCorreta);
  DFF inst344 (.CLRN(inst310_out), .CLK(inst614_out), .D(_1_2), .PRN(1'b1), .Q(_2_2));
  DFF inst347 (.CLRN(inst346_out), .CLK(inst618_out), .D(_2_2), .PRN(1'b1), .Q(_3_2));
  DFF inst354 (.CLRN(inst353_out), .CLK(inst619_out), .D(_3_2), .PRN(1'b1), .Q(_4_2));
  DFF inst196 (.CLRN(inst186_out), .CLK(inst591_out), .D(1'b1), .PRN(1'b1), .Q(_1_2));
  DFF inst3 (.CLRN(inst795_out), .CLK(cancela), .D(anel1led1), .PRN(1'b1), .Q(cancelaanel1));
  nor inst795 (inst795_out, cancelaanel1, reseta, \1pulso );
  not inst66 (inst66_out, \1pulso );
  nor inst119 (inst119_out, confirmacaototal, cancelaanel2, reseta);
  nor inst121 (inst121_out, confirmacaototal, cancelaanel3, reseta);
  nor inst123 (inst123_out, confirmacaototal, cancelaanel4, reseta);
  not inst1 (inst1_out, \1pulso );
  nor inst125 (inst125_out, confirmacaototal, cancela, reseta);
  DFF inst2 (.CLRN(inst795_out), .CLK(proximo), .D(inst1_out), .PRN(1'b1), .Q(inst2_q));
  and inst307 (inst307_out, inst66_out, confirma);
  not inst393 (inst393_out, LED2);
  not inst391 (inst391_out, LED3);
  not inst386 (inst386_out, LED4);
  \74190  inst86 (
    .LDN(1'b1), .A(1'b1), .C(1'b1), .B(1'b1), .D(1'b1), .GN(1'b0), .CLK(proximo), .DNUP(mudaanterior),
    .QA(A1), .QB(B1), .QD(D1), .QC(C1));  // open: MXMN, RCON
  not inst395 (inst395_out, LED1);
  \74373  inst703 (
    .D1(1'b0), .D3(1'b0), .D6(1'b0), .D7(1'b0), .D2(1'b0), .G(1'b1), .D4(1'b1), .D5(1'b1), .OEN(1'b0),
    .Q3(inst703_q3), .Q6(inst703_q6), .Q7(inst703_q7), .Q2(inst703_q2), .Q4(inst703_q4), .Q5(inst703_q5),
    .Q1(inst703_q1));  // open: D8, Q8
  \74373  inst349 (
    .D1(SEGA), .D3(SEGC), .D6(SEGF), .D7(SEGG), .D2(SEGB), .G(inst393_out), .D4(SEGD), .D5(SEGE), .OEN(1'b0),
    .Q3(inst349_q3), .Q6(inst349_q6), .Q7(inst349_q7), .Q2(inst349_q2), .Q4(inst349_q4), .Q5(inst349_q5),
    .Q1(inst349_q1));  // open: D8, Q8
  nor inst303 (inst303_out, cancelaanel1, reseta, inst307_out);
  JKFF inst120 (.PRN(1'b1), .CLRN(inst119_out), .K(1'b0), .J(1'b1), .CLK(confirma), .Q(confirmacao1nbarrado));
  JKFF inst122 (.PRN(1'b1), .CLRN(inst121_out), .K(1'b0), .J(\1pulso ), .CLK(confirma), .Q(inst122_q));
  JKFF inst124 (.PRN(1'b1), .CLRN(inst123_out), .K(1'b0), .J(\2pulsos ), .CLK(confirma), .Q(inst124_q));
  JKFF inst126 (.PRN(1'b1), .CLRN(inst125_out), .K(1'b0), .J(\3pulsos ), .CLK(confirma), .Q(confirmacao4nbarrado));
  \74373  inst717 (
    .D1(1'b1), .D3(1'b0), .D6(1'b0), .D7(1'b0), .D2(1'b1), .G(1'b1), .D4(1'b0), .D5(1'b0), .OEN(1'b0),
    .Q3(inst717_q3), .Q6(inst717_q6), .Q7(inst717_q7), .Q2(inst717_q2), .Q4(inst717_q4), .Q5(inst717_q5),
    .Q1(inst717_q1));  // open: D8, Q8
  \74373  inst350 (
    .D1(SEGA), .D3(SEGC), .D6(SEGF), .D7(SEGG), .D2(SEGB), .G(inst391_out), .D4(SEGD), .D5(SEGE), .OEN(1'b0),
    .Q3(inst350_q3), .Q6(inst350_q6), .Q7(inst350_q7), .Q2(inst350_q2), .Q4(inst350_q4), .Q5(inst350_q5),
    .Q1(inst350_q1));  // open: D8, Q8
  \74373  inst731 (
    .D1(1'b0), .D3(1'b0), .D6(1'b0), .D7(1'b0), .D2(1'b0), .G(1'b1), .D4(1'b1), .D5(1'b1), .OEN(1'b0),
    .Q3(inst731_q3), .Q6(inst731_q6), .Q7(inst731_q7), .Q2(inst731_q2), .Q4(inst731_q4), .Q5(inst731_q5),
    .Q1(inst731_q1));  // open: D8, Q8
  \74373  inst359 (
    .D1(SEGA), .D3(SEGC), .D6(SEGF), .D7(SEGG), .D2(SEGB), .G(inst386_out), .D4(SEGD), .D5(SEGE), .OEN(1'b0),
    .Q3(inst359_q3), .Q6(inst359_q6), .Q7(inst359_q7), .Q2(inst359_q2), .Q4(inst359_q4), .Q5(inst359_q5),
    .Q1(inst359_q1));  // open: D8, Q8
  and inst796 (inst796_out, \2pulsos , cancela, inst303_out);
  DFF inst8 (.CLRN(inst303_out), .CLK(inst796_out), .D(inst303_out), .PRN(1'b1), .Q(inst8_q));
  \74373  inst685 (
    .D1(1'b0), .D3(1'b0), .D6(1'b0), .D7(1'b0), .D2(1'b0), .G(1'b1), .D4(1'b1), .D5(1'b1), .OEN(1'b0),
    .Q3(inst685_q3), .Q6(inst685_q6), .Q7(inst685_q7), .Q2(inst685_q2), .Q4(inst685_q4), .Q5(inst685_q5),
    .Q1(inst685_q1));  // open: D8, Q8
  \74373  inst348 (
    .D1(SEGA), .D3(SEGC), .D6(SEGF), .D7(SEGG), .D2(SEGB), .G(inst395_out), .D4(SEGD), .D5(SEGE), .OEN(1'b0),
    .Q3(inst348_q3), .Q6(inst348_q6), .Q7(inst348_q7), .Q2(inst348_q2), .Q4(inst348_q4), .Q5(inst348_q5),
    .Q1(inst348_q1));  // open: D8, Q8
  or inst9 (anel1led1, inst2_q, inst8_q);
  not inst131 (confirmacao1, confirmacao1nbarrado);
  not inst132 (confirmacao2, inst122_q);
  not inst135 (confirmacao3, inst124_q);
  not inst138 (confirmacao4, confirmacao4nbarrado);
  \7447  inst89 (
    .LTN(1'b1), .B(B1), .C(C1), .D(D1), .RBIN(1'b1), .BIN(1'b1), .A(A1), .OB(inst89_ob), .OC(inst89_oc),
    .OE(inst89_oe), .OD(inst89_od), .OF(inst89_of), .OG(inst89_og), .OA(inst89_oa));  // open: RBON
  and inst333 (inst333_out, confirmacao1, proximo);
  or inst178 (resetaoucancela, cancela, reseta);
  or inst179 (proximoouanterior, proximo, anterior);
  xnor inst708 (inst708_out, inst703_q1, inst349_q1);
  xnor inst709 (inst709_out, inst703_q2, inst349_q2);
  xnor inst710 (inst710_out, inst703_q3, inst349_q3);
  xnor inst711 (inst711_out, inst703_q4, inst349_q4);
  xnor inst712 (inst712_out, inst703_q5, inst349_q5);
  xnor inst713 (inst713_out, inst703_q6, inst349_q6);
  xnor inst714 (inst714_out, inst703_q7, inst349_q7);
  xnor inst722 (inst722_out, inst717_q1, inst350_q1);
  xnor inst723 (inst723_out, inst717_q2, inst350_q2);
  xnor inst724 (inst724_out, inst717_q3, inst350_q3);
  xnor inst725 (inst725_out, inst717_q4, inst350_q4);
  xnor inst726 (inst726_out, inst717_q5, inst350_q5);
  xnor inst727 (inst727_out, inst717_q6, inst350_q6);
  xnor inst728 (inst728_out, inst717_q7, inst350_q7);
  or inst92 (inst92_out, anel1led1, anel2led1, anel3led1, anel4led1);
  xnor inst736 (inst736_out, inst731_q1, inst359_q1);
  xnor inst737 (inst737_out, inst731_q2, inst359_q2);
  xnor inst738 (inst738_out, inst731_q3, inst359_q3);
  xnor inst739 (inst739_out, inst731_q4, inst359_q4);
  xnor inst740 (inst740_out, inst731_q5, inst359_q5);
  xnor inst741 (inst741_out, inst731_q6, inst359_q6);
  xnor inst742 (inst742_out, inst731_q7, inst359_q7);
  not inst312 (inst312_out, \2pulsos );
  not inst313 (inst313_out, \3pulsos );
  not inst315 (inst315_out, \4pulsos );
  not inst248 (LED1, inst92_out);
  xnor inst694 (inst694_out, inst685_q1, inst348_q1);
  xnor inst695 (inst695_out, inst685_q2, inst348_q2);
  xnor inst696 (inst696_out, inst685_q3, inst348_q3);
  xnor inst697 (inst697_out, inst685_q4, inst348_q4);
  xnor inst698 (inst698_out, inst685_q5, inst348_q5);
  xnor inst699 (inst699_out, inst685_q6, inst348_q6);
  xnor inst700 (inst700_out, inst685_q7, inst348_q7);
  and inst715 (inst715_out, inst708_out, inst709_out, inst710_out, inst711_out, inst712_out, inst713_out, inst714_out);
  and inst314 (inst314_out, confirma, \1pulso , inst312_out, inst313_out, inst315_out);
  \74373  inst91 (
    .D1(inst89_oa), .D3(inst89_oc), .D6(inst89_of), .D7(inst89_og), .D2(inst89_ob), .G(inst333_out),
    .D4(inst89_od), .D5(inst89_oe), .D8(\1tentativa ), .OEN(LED1), .Q3(SEGC), .Q6(SEGF), .Q7(SEGG),
    .Q2(SEGB), .Q8(DP), .Q4(SEGD), .Q5(SEGE), .Q1(SEGA));
  and inst729 (inst729_out, inst722_out, inst723_out, inst724_out, inst725_out, inst726_out, inst727_out, inst728_out);
  and inst743 (inst743_out, inst736_out, inst737_out, inst738_out, inst739_out, inst740_out, inst741_out, inst742_out);
  and inst701 (inst701_out, inst694_out, inst695_out, inst696_out, inst697_out, inst698_out, inst699_out, inst700_out);
  nor inst388 (inst388_out, reseta, cancelaanel4, confirmacaototal);
  nor inst13 (inst13_out, cancelaanel2, proximo, inst314_out, anel2led1);
  nor inst370 (inst370_out, reseta, cancelaanel1, confirmacaototal);
  and inst745 (inst745_out, confirma, inst715_out, confirmacao2, LedSenhaCorreta2);
  nor inst375 (inst375_out, reseta, cancelaanel2, confirmacaototal);
  and inst746 (inst746_out, confirmacao3, LedSenhaCorreta2, inst729_out, confirma);
  nor inst379 (inst379_out, reseta, cancelaanel3, confirmacaototal);
  and inst747 (inst747_out, confirma, inst743_out, confirmacao4, LedSenhaCorreta2);
  and inst744 (inst744_out, LedSenhaCorreta2, confirma, inst701_out, confirmacao1);
  not inst15 (inst15_out, \2pulsos );
  DFF inst376 (.CLRN(inst375_out), .CLK(inst745_out), .D(_1_3), .PRN(1'b1), .Q(_2_3));
  DFF inst380 (.CLRN(inst379_out), .CLK(inst746_out), .D(_2_3), .PRN(1'b1), .Q(_3_3));
  DFF inst389 (.CLRN(inst388_out), .CLK(inst747_out), .D(_3_3), .PRN(1'b1), .Q(_4_3));
  or inst16 (anel2, anel2led1, anel2led2);
  DFF inst14 (.CLRN(inst13_out), .CLK(inst15_out), .D(\1pulso ), .PRN(1'b1), .Q(cancelaanel3_2));
  not inst19 (inst19_out, \2pulsos );
  DFF inst31 (.CLRN(inst21_out), .CLK(cancela), .D(anel2), .PRN(1'b1), .Q(cancelaanel2));
  DFF inst372 (.CLRN(inst370_out), .CLK(inst744_out), .D(1'b1), .PRN(1'b1), .Q(_1_3));
  DFF inst17 (.CLRN(inst20_out), .CLK(\1pulso ), .D(inst19_out), .PRN(1'b1), .Q(inst17_q));
  xnor inst255 (inst255_out, 1'b1, proximo_);
  xnor inst258 (inst258_out, 1'b1, chavemestre_);
  xnor inst261 (inst261_out, 1'b1, confirma_);
  xnor inst264 (inst264_out, 1'b1, reseta_);
  xnor inst267 (inst267_out, 1'b1, cancela_);
  nor inst20 (inst20_out, anel2led1, cancelaanel2, reseta, \2pulsos );
  DLATCH inst250 (.CLRN(inst254_out), .D(anterior_), .ENA(1'b1), .PRN(1'b1), .Q(inst250_q));
  xnor inst254 (inst254_out, 1'b1, anterior_);
  DLATCH inst252 (.CLRN(inst255_out), .D(proximo_), .ENA(1'b1), .PRN(1'b1), .Q(inst252_q));
  DLATCH inst256 (.CLRN(inst258_out), .D(chavemestre_), .ENA(1'b1), .PRN(1'b1), .Q(inst256_q));
  DLATCH inst259 (.CLRN(inst261_out), .D(confirma_), .ENA(1'b1), .PRN(1'b1), .Q(inst259_q));
  DLATCH inst262 (.CLRN(inst264_out), .D(reseta_), .ENA(1'b1), .PRN(1'b1), .Q(reseta));
  DLATCH inst265 (.CLRN(inst267_out), .D(cancela_), .ENA(1'b1), .PRN(1'b1), .Q(inst265_q));
  or inst317 (inst317_out, cancelaanel3_2, inst17_q);
  \74190  inst95 (
    .LDN(1'b1), .A(1'b1), .C(1'b1), .B(1'b1), .D(1'b1), .GN(1'b0), .CLK(proximo), .DNUP(mudaanterior),
    .QA(A2), .QB(B2), .QD(D2), .QC(C2));  // open: MXMN, RCON
  not inst288 (inst288_out, buzzer);
  not inst290 (inst290_out, buzzer);
  and inst22 (inst22_out, inst317_out, inst23_out);
  not inst23 (inst23_out, inst281_cout);
  nor inst21 (inst21_out, cancelaanel2, \2pulsos , reseta);
  not inst284 (inst284_out, buzzer);
  not inst286 (inst286_out, buzzer);
  not inst294 (inst294_out, buzzer);
  and inst285 (anterior, inst250_q, inst284_out);
  and inst287 (inst287_out, inst252_q, inst286_out);
  and inst289 (CHAVEMESTRE, inst256_q, inst288_out);
  and inst291 (inst291_out, inst259_q, inst290_out);
  and inst295 (inst295_out, inst265_q, inst294_out);
  clock1hz inst281 (.clock(ClockFPGA), .cout(inst281_cout));  // open: q
  TFF inst292 (.PRN(1'b1), .CLRN(1'b1), .T(1'b1), .CLK(anterior), .Q(mudaanterior));
  \7447  inst98 (
    .LTN(1'b1), .B(B2), .C(C2), .D(D2), .RBIN(1'b1), .BIN(1'b1), .A(A2), .OB(inst98_ob), .OC(inst98_oc),
    .OE(inst98_oe), .OD(inst98_od), .OF(inst98_of), .OG(inst98_og), .OA(inst98_oa));  // open: RBON
  TFF inst343 (.PRN(1'b1), .CLRN(inst758_out), .T(1'b1), .CLK(inst291_out), .Q(confirma));
  TFF inst299 (.PRN(1'b1), .CLRN(inst754_out), .T(1'b1), .CLK(inst295_out), .Q(cancela));
  not inst26 (inst26_out, inst22_out);
  and inst334 (inst334_out, confirmacao2, proximo);
  clock3hz inst759 (.clock(ClockFPGA), .cout(inst759_cout));  // open: q
  clock3hz inst750 (.clock(ClockFPGA), .cout(inst750_cout));  // open: q
  JKFF inst25 (.PRN(inst26_out), .CLRN(inst21_out), .K(inst29_out), .J(anel2led2), .CLK(inst281_cout), .Q(anel2led1));
  or inst101 (inst101_out, anel4led2, anel2led2, anel3led2, cancelaanel3_2);
  TFF inst298 (.PRN(1'b1), .CLRN(1'b1), .T(1'b1), .CLK(inst287_out), .Q(proximo));
  not inst247 (LED2, inst101_out);
  not inst28 (inst28_out, anel2led1);
  DFF inst755 (.CLRN(inst758_out), .CLK(inst759_cout), .D(confirma), .PRN(1'b1), .Q(inst755_q));
  DFF inst751 (.CLRN(inst754_out), .CLK(inst750_cout), .D(cancela), .PRN(1'b1), .Q(inst751_q));
  JKFF inst27 (.PRN(1'b1), .CLRN(inst21_out), .K(inst28_out), .J(anel2led1), .CLK(inst281_cout), .Q(anel2led2));
  \74373  inst100 (
    .D1(inst98_oa), .D3(inst98_oc), .D6(inst98_of), .D7(inst98_og), .D2(inst98_ob), .G(inst334_out),
    .D4(inst98_od), .D5(inst98_oe), .D8(\2tentativas ), .OEN(LED2), .Q3(SEGC), .Q6(SEGF), .Q7(SEGG),
    .Q2(SEGB), .Q8(DP), .Q4(SEGD), .Q5(SEGE), .Q1(SEGA));
  DFF inst756 (.CLRN(inst758_out), .CLK(inst759_cout), .D(inst755_q), .PRN(1'b1), .Q(inst756_q));
  DFF inst752 (.CLRN(inst754_out), .CLK(inst750_cout), .D(inst751_q), .PRN(1'b1), .Q(inst752_q));
  not inst29 (inst29_out, anel2led2);
  not inst758 (inst758_out, inst756_q);
  not inst754 (inst754_out, inst752_q);
  not inst430 (inst430_out, reseta);
  not inst432 (inst432_out, CHAVEMESTRE);
  not inst319 (inst319_out, \3pulsos );
  not inst329 (inst329_out, \4pulsos );
  and inst429 (inst429_out, CHAVEMESTRE, inst430_out);
  and inst431 (inst431_out, inst430_out, inst432_out);
  and inst320 (inst320_out, confirma, \1pulso , \2pulsos , inst319_out, inst329_out);
  not inst7 (inst7_out, \2pulsos );
  not inst24 (inst24_out, \3pulsos );
  not inst83 (inst83_out, \4pulsos );
  not inst575 (inst575_out, LED4);
  clock3hz inst770 (.clock(ClockFPGA), .cout(inst770_cout));  // open: q
  nor inst33 (inst33_out, cancelaanel3, proximo, inst320_out, anel3led1);
  not inst396 (inst396_out, LED4);
  and inst433 (LEled4, inst396_out, inst429_out);
  and inst437 (LEMESTREled4, inst575_out, inst431_out);
  and inst6 (inst6_out, \1pulso , inst7_out, inst24_out, inst83_out);
  not inst398 (inst398_out, LED3);
  and inst438 (LEMESTREled3, inst577_out, inst431_out);
  not inst577 (inst577_out, LED3);
  and inst434 (LEled3, inst398_out, inst429_out);
  not inst578 (inst578_out, LED2);
  and inst93 (inst93_out, \2pulsos , inst24_out, inst83_out);
  and inst102 (inst102_out, \3pulsos , inst83_out);
  DFF inst766 (.CLRN(inst769_out), .CLK(inst770_cout), .D(inst760_q), .PRN(1'b1), .Q(inst766_q));
  DFF inst771 (.CLRN(inst774_out), .CLK(inst770_cout), .D(inst762_q), .PRN(1'b1), .Q(inst771_q));
  DFF inst775 (.CLRN(inst778_out), .CLK(inst770_cout), .D(inst764_q), .PRN(1'b1), .Q(inst775_q));
  DFF inst779 (.CLRN(inst782_out), .CLK(inst770_cout), .D(inst765_q), .PRN(1'b1), .Q(inst779_q));
  not inst35 (inst35_out, \3pulsos );
  not inst39 (inst39_out, \3pulsos );
  not inst557 (inst557_out, LED2);
  and inst435 (LEled2, inst557_out, inst429_out);
  and inst439 (LEMESTREled2, inst578_out, inst431_out);
  DFF inst767 (.CLRN(inst769_out), .CLK(inst770_cout), .D(inst766_q), .PRN(1'b1), .Q(inst767_q));
  DFF inst772 (.CLRN(inst774_out), .CLK(inst770_cout), .D(inst771_q), .PRN(1'b1), .Q(inst772_q));
  DFF inst776 (.CLRN(inst778_out), .CLK(inst770_cout), .D(inst775_q), .PRN(1'b1), .Q(inst776_q));
  DFF inst41 (.CLRN(inst43_out), .CLK(cancela), .D(anel3), .PRN(1'b1), .Q(cancelaanel3));
  \74190  inst104 (
    .LDN(1'b1), .A(1'b1), .C(1'b1), .B(1'b1), .D(1'b1), .GN(1'b0), .CLK(proximo), .DNUP(mudaanterior),
    .QA(A3), .QB(B3), .QD(D3), .QC(C3));  // open: MXMN, RCON
  not inst561 (inst561_out, LED1);
  and inst436 (LEled1, inst561_out, inst429_out);
  and inst440 (LEMESTREled1, inst590_out, inst431_out);
  not inst590 (inst590_out, LED1);
  DFF inst321 (.CLRN(inst223_out), .CLK(cancela), .D(inst6_out), .PRN(1'b1), .Q(inst321_q));
  not inst774 (inst774_out, inst772_q);
  not inst778 (inst778_out, inst776_q);
  DFF inst780 (.CLRN(inst782_out), .CLK(inst770_cout), .D(inst779_q), .PRN(1'b1), .Q(inst780_q));
  DFF inst34 (.CLRN(inst33_out), .CLK(inst35_out), .D(\2pulsos ), .PRN(1'b1), .Q(cancelaanel4_2));
  and inst228 (inst228_out, resetabagaca, CHAVEMESTRE);
  not inst769 (inst769_out, inst767_q);
  not inst782 (inst782_out, inst780_q);
  DFF inst36 (.CLRN(inst40_out), .CLK(\2pulsos ), .D(inst39_out), .PRN(1'b1), .Q(inst36_q));
  not inst297 (inst297_out, \1pulsosom );
  and inst227 (inst227_out, \1tentativa , inst221_out);
  or inst330 (inst330_out, cancelaanel4_2, inst36_q);
  nor inst40 (inst40_out, anel3led1, cancelaanel3, \3pulsos , reseta);
  and inst139 (inst139_out, confirma, inst297_out);
  or inst222 (resetabagaca, reseta, inst321_q, inst227_out);
  nor inst235 (inst235_out, inst228_out, reseta);
  not inst46 (inst46_out, inst282_cout);
  nor inst43 (inst43_out, cancelaanel3, \3pulsos , reseta);
  not inst223 (inst223_out, resetabagaca);
  or inst269 (anel3, anel3led1, anel3led2, anel3led3);
  and inst44 (inst44_out, inst330_out, inst46_out);
  \7447  inst107 (
    .LTN(1'b1), .B(B3), .C(C3), .D(D3), .RBIN(1'b1), .BIN(1'b1), .A(A3), .OB(inst107_ob), .OC(inst107_oc),
    .OE(inst107_oe), .OD(inst107_od), .OF(inst107_of), .OG(inst107_og), .OA(inst107_oa));  // open: RBON
  DFF inst213 (.CLRN(inst223_out), .CLK(inst139_out), .D(1'b1), .PRN(1'b1), .Q(\1pulso ));
  DFF inst230 (.CLRN(inst235_out), .CLK(inst221_out), .D(1'b1), .PRN(1'b1), .Q(\1tentativa ));
  clock1hz inst282 (.clock(ClockFPGA), .cout(inst282_cout));  // open: q
  or inst110 (inst110_out, anel3led3, anel4led3);
  and inst335 (inst335_out, confirmacao3, proximo);
  \74373  inst142 (
    .D1(SEGA), .D3(SEGC), .D6(SEGF), .D7(SEGG), .D2(SEGB), .G(LEled1), .D4(SEGD), .D5(SEGE), .OEN(1'b0),
    .Q3(inst142_q3), .Q6(inst142_q6), .Q7(inst142_q7), .Q2(inst142_q2), .Q8(inst142_q8), .Q4(inst142_q4),
    .Q5(inst142_q5), .Q1(inst142_q1));  // open: D8
  \74373  inst180 (
    .D1(SEGA), .D3(SEGC), .D6(SEGF), .D7(SEGG), .D2(SEGB), .G(LEMESTREled1), .D4(SEGD), .D5(SEGE),
    .OEN(1'b0), .Q3(inst180_q3), .Q6(inst180_q6), .Q7(inst180_q7), .Q2(inst180_q2), .Q8(inst180_q8),
    .Q4(inst180_q4), .Q5(inst180_q5), .Q1(inst180_q1));  // open: D8
  \74373  inst158 (
    .D1(SEGA), .D3(SEGC), .D6(SEGF), .D7(SEGG), .D2(SEGB), .G(LEled2), .D4(SEGD), .D5(SEGE), .OEN(1'b0),
    .Q3(inst158_q3), .Q6(inst158_q6), .Q7(inst158_q7), .Q2(inst158_q2), .Q8(inst158_q8), .Q4(inst158_q4),
    .Q5(inst158_q5), .Q1(inst158_q1));  // open: D8
  \74373  inst157 (
    .D1(SEGA), .D3(SEGC), .D6(SEGF), .D7(SEGG), .D2(SEGB), .G(LEMESTREled2), .D4(SEGD), .D5(SEGE),
    .OEN(1'b0), .Q3(inst157_q3), .Q6(inst157_q6), .Q7(inst157_q7), .Q2(inst157_q2), .Q8(inst157_q8),
    .Q4(inst157_q4), .Q5(inst157_q5), .Q1(inst157_q1));  // open: D8
  DFF inst323 (.CLRN(inst224_out), .CLK(cancela), .D(inst93_out), .PRN(1'b1), .Q(inst323_q));
  not inst246 (LED3, inst110_out);
  DFF inst214 (.CLRN(inst224_out), .CLK(confirma), .D(\1pulso ), .PRN(1'b1), .Q(\2pulsos ));
  nor inst224 (inst224_out, resetabagaca, inst323_q);
  DFF inst231 (.CLRN(inst235_out), .CLK(inst221_out), .D(\1tentativa ), .PRN(1'b1), .Q(\2tentativas ));
  xnor inst569 (inst569_out, 1'b1, ChaveMi);
  DLATCH inst570 (.CLRN(inst572_out), .D(ChaveFa), .ENA(1'b1), .PRN(1'b1), .Q(inst570_q));
  xnor inst572 (inst572_out, 1'b1, ChaveFa);
  DLATCH inst296 (.CLRN(inst563_out), .D(ChaveDo), .ENA(1'b1), .PRN(1'b1), .Q(inst296_q));
  xnor inst563 (inst563_out, 1'b1, ChaveDo);
  xnor inst566 (inst566_out, 1'b1, ChaveRe);
  DLATCH inst567 (.CLRN(inst569_out), .D(ChaveMi), .ENA(1'b1), .PRN(1'b1), .Q(inst567_q));
  \74373  inst109 (
    .D1(inst107_oa), .D3(inst107_oc), .D6(inst107_of), .D7(inst107_og), .D2(inst107_ob), .G(inst335_out),
    .D4(inst107_od), .D5(inst107_oe), .D8(\3tentativas ), .OEN(LED3), .Q3(SEGC), .Q6(SEGF), .Q7(SEGG),
    .Q2(SEGB), .Q8(DP), .Q4(SEGD), .Q5(SEGE), .Q1(SEGA));
  DFF inst232 (.CLRN(inst235_out), .CLK(inst221_out), .D(\2tentativas ), .PRN(1'b1), .Q(\3tentativas ));
  DLATCH inst564 (.CLRN(inst566_out), .D(ChaveRe), .ENA(1'b1), .PRN(1'b1), .Q(inst564_q));
  not inst52 (inst52_out, inst44_out);
  JKFF inst47 (.PRN(inst52_out), .CLRN(inst43_out), .K(inst53_out), .J(anel3led3), .CLK(inst282_cout), .Q(anel3led1));
  DFF inst325 (.CLRN(inst225_out), .CLK(cancela), .D(inst102_out), .PRN(1'b1), .Q(inst325_q));
  TFF inst764 (.PRN(1'b1), .CLRN(inst778_out), .T(1'b1), .CLK(inst567_q), .Q(inst764_q));
  TFF inst765 (.PRN(1'b1), .CLRN(inst782_out), .T(1'b1), .CLK(inst570_q), .Q(inst765_q));
  DFF inst215 (.CLRN(inst225_out), .CLK(confirma), .D(\2pulsos ), .PRN(1'b1), .Q(\3pulsos ));
  nor inst225 (inst225_out, inst325_q, resetabagaca);
  TFF inst760 (.PRN(1'b1), .CLRN(inst769_out), .T(1'b1), .CLK(inst296_q), .Q(inst760_q));
  TFF inst762 (.PRN(1'b1), .CLRN(inst774_out), .T(1'b1), .CLK(inst564_q), .Q(inst762_q));
  not inst50 (inst50_out, anel3led1);
  xnor inst144 (inst144_out, inst142_q1, inst180_q1);
  xnor inst145 (inst145_out, inst142_q2, inst180_q2);
  xnor inst146 (inst146_out, inst142_q3, inst180_q3);
  xnor inst147 (inst147_out, inst142_q4, inst180_q4);
  xnor inst148 (inst148_out, inst142_q5, inst180_q5);
  xnor inst149 (inst149_out, inst142_q6, inst180_q6);
  xnor inst150 (inst150_out, inst142_q7, inst180_q7);
  xnor inst151 (inst151_out, inst142_q8, inst180_q8);
  xnor inst160 (inst160_out, inst158_q1, inst157_q1);
  xnor inst161 (inst161_out, inst158_q2, inst157_q2);
  xnor inst162 (inst162_out, inst158_q3, inst157_q3);
  xnor inst163 (inst163_out, inst158_q4, inst157_q4);
  xnor inst164 (inst164_out, inst158_q5, inst157_q5);
  xnor inst165 (inst165_out, inst158_q6, inst157_q6);
  xnor inst166 (inst166_out, inst158_q7, inst157_q7);
  xnor inst167 (inst167_out, inst158_q8, inst157_q8);
  DFF inst233 (.CLRN(inst235_out), .CLK(inst221_out), .D(\3tentativas ), .PRN(1'b1), .Q(\4tentativas ));
  nor inst45 (inst45_out, resetabagaca, inst327_q);
  JKFF inst48 (.PRN(1'b1), .CLRN(inst43_out), .K(inst50_out), .J(anel3led1), .CLK(inst282_cout), .Q(anel3led2));
  DFF inst216 (.CLRN(inst45_out), .CLK(confirma), .D(\3pulsos ), .PRN(1'b1), .Q(\4pulsos ));
  DFF inst234 (.CLRN(inst235_out), .CLK(inst221_out), .D(\4tentativas ), .PRN(1'b1), .Q(buzzer));
  not inst51 (inst51_out, anel3led2);
  and inst221 (inst221_out, \4pulsos , confirmacaototal);
  JKFF inst49 (.PRN(1'b1), .CLRN(inst43_out), .K(inst51_out), .J(anel3led2), .CLK(inst282_cout), .Q(anel3led3));
  clockbuzzer1k inst111 (.clock(ClockFPGA), .cout(inst111_cout));  // open: q
  BuzzerDo inst (.clock(ClockFPGA), .cout(inst_cout));  // open: q
  BuzzerRe inst37 (.clock(ClockFPGA), .cout(inst37_cout));  // open: q
  BuzzerMi inst94 (.clock(ClockFPGA), .cout(inst94_cout));  // open: q
  BuzzerFa inst112 (.clock(ClockFPGA), .cout(inst112_cout));  // open: q
  not inst53 (inst53_out, anel3led3);
  DFF inst327 (.CLRN(inst45_out), .CLK(cancela), .D(\4pulsos ), .PRN(1'b1), .Q(inst327_q));
  not inst275 (inst275_out, LedSenhaCorreta3);
  \74373  inst152 (
    .D1(inst144_out), .D3(inst146_out), .D6(inst149_out), .D7(inst150_out), .D2(inst145_out), .G(1'b1),
    .D4(inst147_out), .D5(inst148_out), .D8(inst151_out), .OEN(1'b0), .Q3(inst152_q3), .Q6(inst152_q6),
    .Q7(inst152_q7), .Q2(inst152_q2), .Q8(inst152_q8), .Q4(inst152_q4), .Q5(inst152_q5), .Q1(inst152_q1));
  \74373  inst168 (
    .D1(inst160_out), .D3(inst162_out), .D6(inst165_out), .D7(inst166_out), .D2(inst161_out), .G(1'b1),
    .D4(inst163_out), .D5(inst164_out), .D8(inst167_out), .OEN(1'b0), .Q3(inst168_q3), .Q6(inst168_q6),
    .Q7(inst168_q7), .Q2(inst168_q2), .Q8(inst168_q8), .Q4(inst168_q4), .Q5(inst168_q5), .Q1(inst168_q1));
  clockbuzzer inst272 (.clock(ClockFPGA), .cout(inst272_cout));  // open: q
  and inst140 (inst140_out, inst273_q, inst275_out, buzzer);
  TFF inst276 (.PRN(1'b1), .CLRN(1'b1), .T(1'b1), .CLK(inst111_cout), .Q(inst276_q));
  TFF inst18 (.PRN(1'b1), .CLRN(1'b1), .T(1'b1), .CLK(inst_cout), .Q(inst18_q));
  TFF inst85 (.PRN(1'b1), .CLRN(1'b1), .T(1'b1), .CLK(inst37_cout), .Q(inst85_q));
  TFF inst103 (.PRN(1'b1), .CLRN(1'b1), .T(1'b1), .CLK(inst94_cout), .Q(inst103_q));
  TFF inst268 (.PRN(1'b1), .CLRN(1'b1), .T(1'b1), .CLK(inst112_cout), .Q(inst268_q));
  and inst154 (inst154_out, inst152_q1, inst152_q2, inst152_q3, inst152_q4, inst152_q5, inst152_q6, inst152_q7, inst152_q8);
  and inst170 (inst170_out, inst168_q1, inst168_q2, inst168_q3, inst168_q4, inst168_q5, inst168_q6, inst168_q7, inst168_q8);
  and inst309 (inst309_out, inst273_q, confirma);
  and inst278 (inst278_out, cancela, inst276_q);
  and inst280 (inst280_out, inst18_q, inst760_q);
  and inst302 (inst302_out, inst85_q, inst762_q);
  and inst304 (inst304_out, inst103_q, inst764_q);
  and inst308 (inst308_out, inst268_q, inst765_q);
  or inst301 (inst301_out, inst309_out, inst278_out, inst140_out);
  not inst55 (inst55_out, \4pulsos );
  TFF inst273 (.PRN(1'b1), .CLRN(1'b1), .T(1'b1), .CLK(inst272_cout), .Q(inst273_q));
  DFF inst54 (.CLRN(inst58_out), .CLK(\3pulsos ), .D(inst55_out), .PRN(1'b1), .Q(inst54_q));
  DFF inst60 (.CLRN(inst62_out), .CLK(cancela), .D(anel4), .PRN(1'b1), .Q(cancelaanel4));
  not inst270 (inst270_out, resetabagaca);
  or inst279 (inst279_out, inst280_out, inst302_out, inst304_out, inst308_out);
  or inst56 (anel4, anel4led1, anel4led2, anel4led3, anel4led4);
  nor inst58 (inst58_out, cancelaanel4, anel4led1, \4pulsos , reseta);
  and inst331 (inst331_out, confirmacao4nbarrado, cancela);
  DFF inst63 (.CLRN(inst332_out), .CLK(confirma), .D(confirmacao4nbarrado), .PRN(1'b1), .Q(confirmacaototal));
  or inst332 (inst332_out, inst270_out, inst331_out);
  and inst428 (inst428_out, inst154_out, inst170_out, inst409_out, inst422_out);
  or inst600 (ALERTA, inst301_out, inst279_out);
  nor inst62 (inst62_out, reseta, cancelaanel4, confirmacaototal);
  \74190  inst113 (
    .LDN(1'b1), .A(1'b1), .C(1'b1), .B(1'b1), .D(1'b1), .GN(1'b0), .CLK(proximo), .DNUP(mudaanterior),
    .QA(A4), .QB(B4), .QD(D4), .QC(C4));  // open: MXMN, RCON
  DFF inst172 (.CLRN(inst229_out), .CLK(\4pulsos ), .D(inst428_out), .PRN(1'b1), .Q(SAIDAMESTRE));
  not inst229 (inst229_out, reseta);
  not inst68 (inst68_out, inst283_cout);
  and inst67 (inst67_out, inst54_q, inst68_out);
  clock1hz inst283 (.clock(ClockFPGA), .cout(inst283_cout));  // open: q
  \7447  inst116 (
    .LTN(1'b1), .B(B4), .C(C4), .D(D4), .RBIN(1'b1), .BIN(1'b1), .A(A4), .OB(inst116_ob), .OC(inst116_oc),
    .OE(inst116_oe), .OD(inst116_od), .OF(inst116_of), .OG(inst116_og), .OA(inst116_oa));  // open: RBON
  and inst336 (inst336_out, confirmacao4, proximo);
  and inst409 (inst409_out, inst407_q1, inst407_q2, inst407_q3, inst407_q4, inst407_q5, inst407_q6, inst407_q7, inst407_q8);
  and inst422 (inst422_out, inst420_q1, inst420_q2, inst420_q3, inst420_q4, inst420_q5, inst420_q6, inst420_q7, inst420_q8);
  not inst77 (inst77_out, inst67_out);
  JKFF inst69 (.PRN(inst77_out), .CLRN(inst62_out), .K(inst76_out), .J(anel4led4), .CLK(inst283_cout), .Q(anel4led1));
  not inst245 (LED4, anel4led4);
  \74373  inst407 (
    .D1(inst156_out), .D3(inst175_out), .D6(inst181_out), .D7(inst188_out), .D2(inst174_out), .G(1'b1),
    .D4(inst176_out), .D5(inst177_out), .D8(inst406_out), .OEN(1'b0), .Q3(inst407_q3), .Q6(inst407_q6),
    .Q7(inst407_q7), .Q2(inst407_q2), .Q8(inst407_q8), .Q4(inst407_q4), .Q5(inst407_q5), .Q1(inst407_q1));
  \74373  inst420 (
    .D1(inst412_out), .D3(inst414_out), .D6(inst417_out), .D7(inst418_out), .D2(inst413_out), .G(1'b1),
    .D4(inst415_out), .D5(inst416_out), .D8(inst419_out), .OEN(1'b0), .Q3(inst420_q3), .Q6(inst420_q6),
    .Q7(inst420_q7), .Q2(inst420_q2), .Q8(inst420_q8), .Q4(inst420_q4), .Q5(inst420_q5), .Q1(inst420_q1));
  not inst73 (inst73_out, anel4led1);
  \74373  inst118 (
    .D1(inst116_oa), .D3(inst116_oc), .D6(inst116_of), .D7(inst116_og), .D2(inst116_ob), .G(inst336_out),
    .D4(inst116_od), .D5(inst116_oe), .D8(\4tentativas ), .OEN(LED4), .Q3(SEGC), .Q6(SEGF), .Q7(SEGG),
    .Q2(SEGB), .Q8(DP), .Q4(SEGD), .Q5(SEGE), .Q1(SEGA));
  JKFF inst70 (.PRN(1'b1), .CLRN(inst62_out), .K(inst73_out), .J(anel4led1), .CLK(inst283_cout), .Q(anel4led2));
  not inst74 (inst74_out, anel4led2);
  JKFF inst71 (.PRN(1'b1), .CLRN(inst62_out), .K(inst74_out), .J(anel4led2), .CLK(inst283_cout), .Q(anel4led3));
  not inst75 (inst75_out, anel4led3);
  xnor inst156 (inst156_out, inst155_q1, inst425_q1);
  xnor inst174 (inst174_out, inst155_q2, inst425_q2);
  xnor inst175 (inst175_out, inst155_q3, inst425_q3);
  xnor inst176 (inst176_out, inst155_q4, inst425_q4);
  xnor inst177 (inst177_out, inst155_q5, inst425_q5);
  xnor inst181 (inst181_out, inst155_q6, inst425_q6);
  xnor inst188 (inst188_out, inst155_q7, inst425_q7);
